# EAGLE design Schematic (EAGLE 9.6.2)
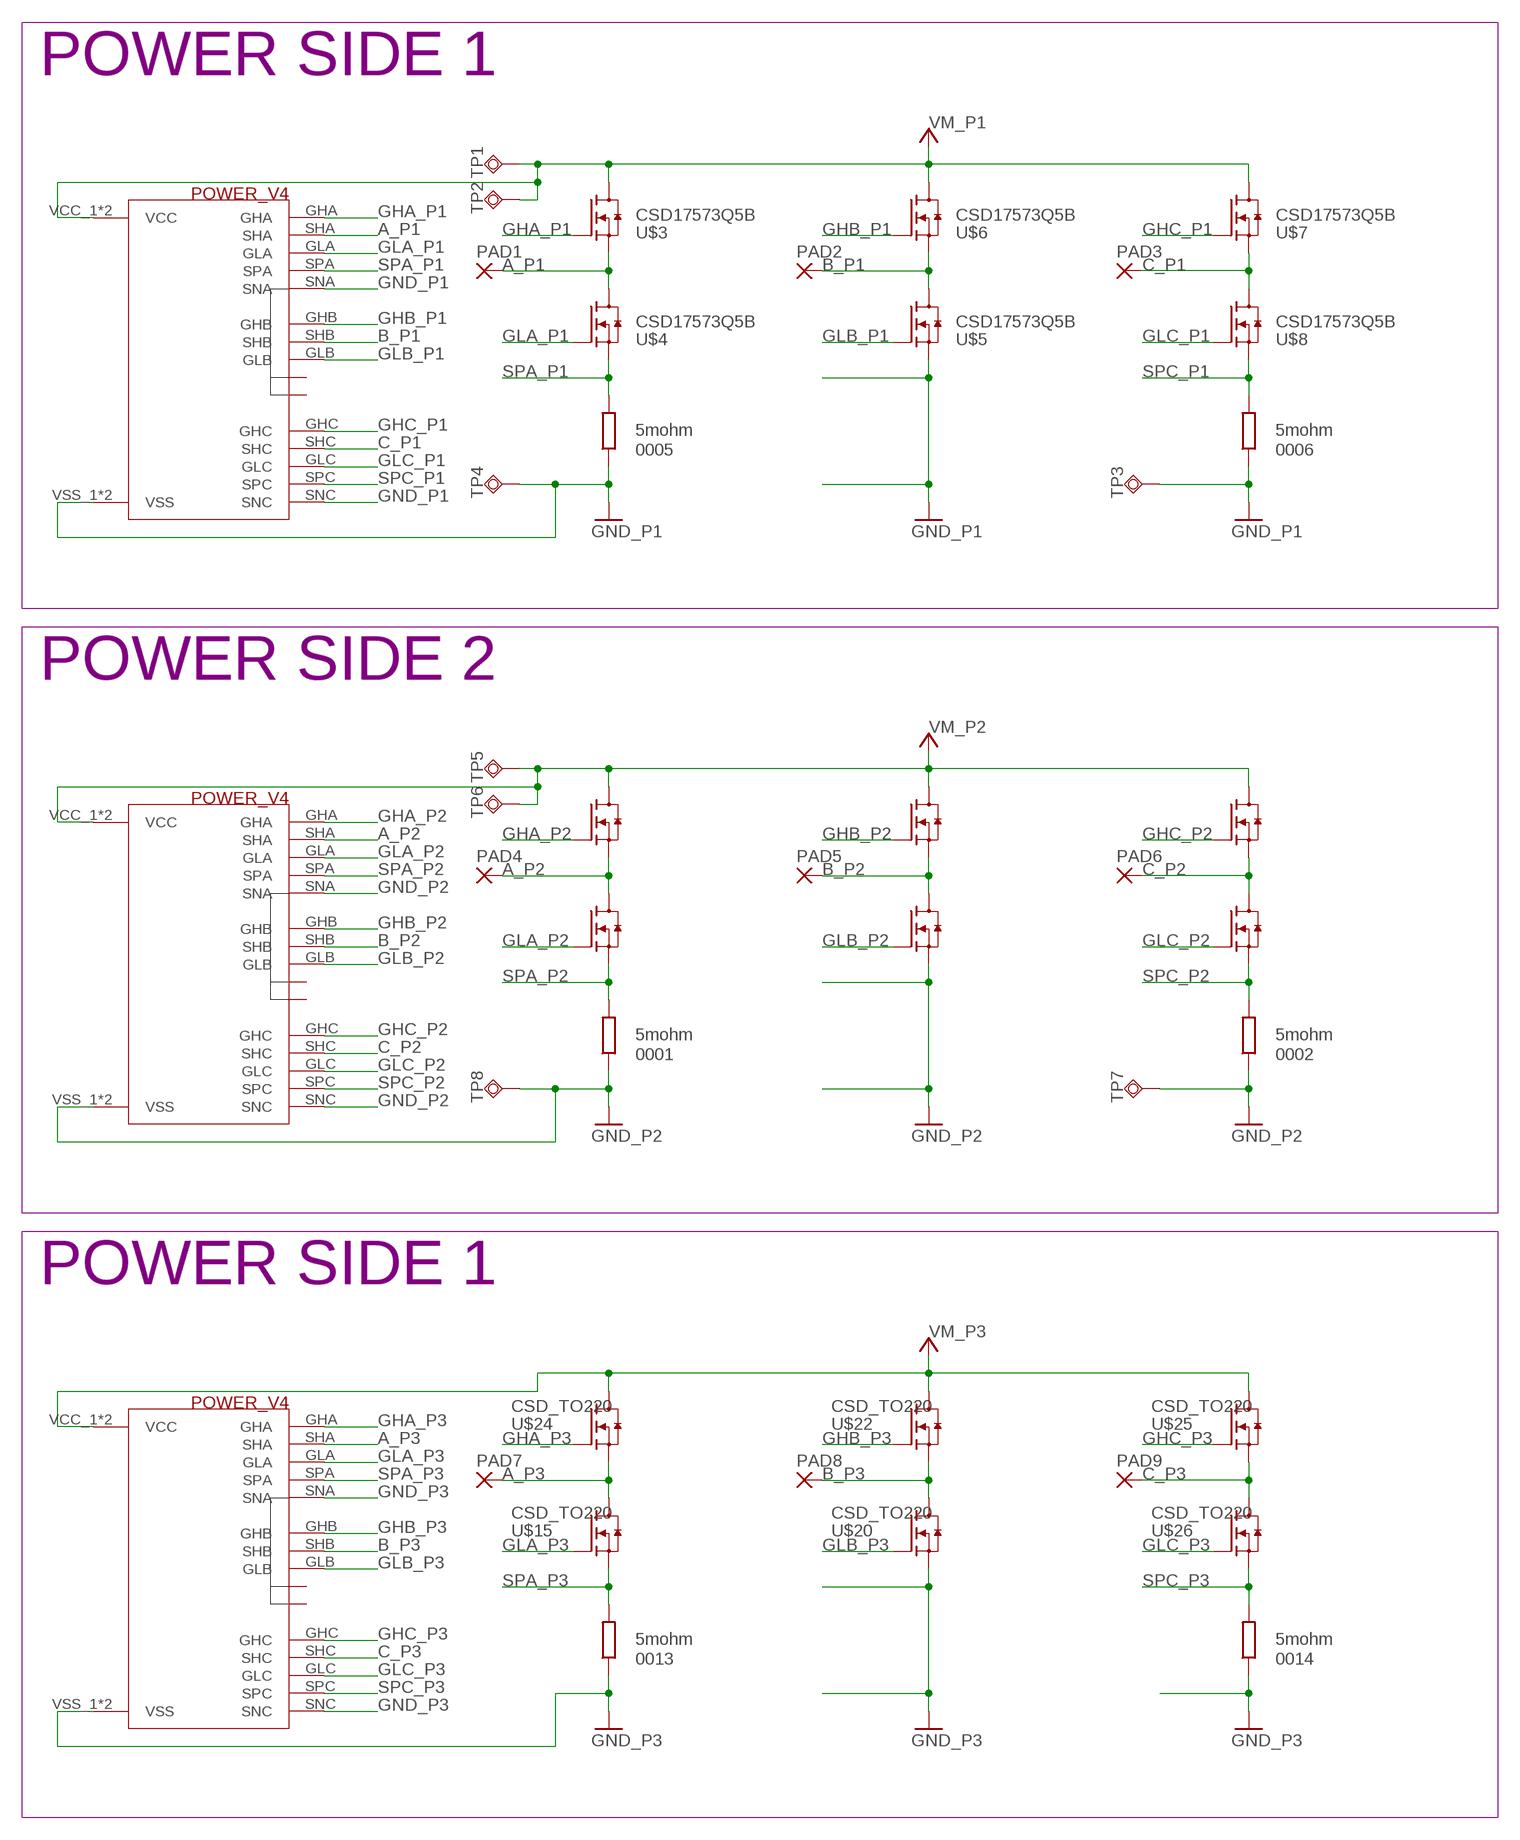
[diagram p0: schematic, sheet 1, part 1 of 3]
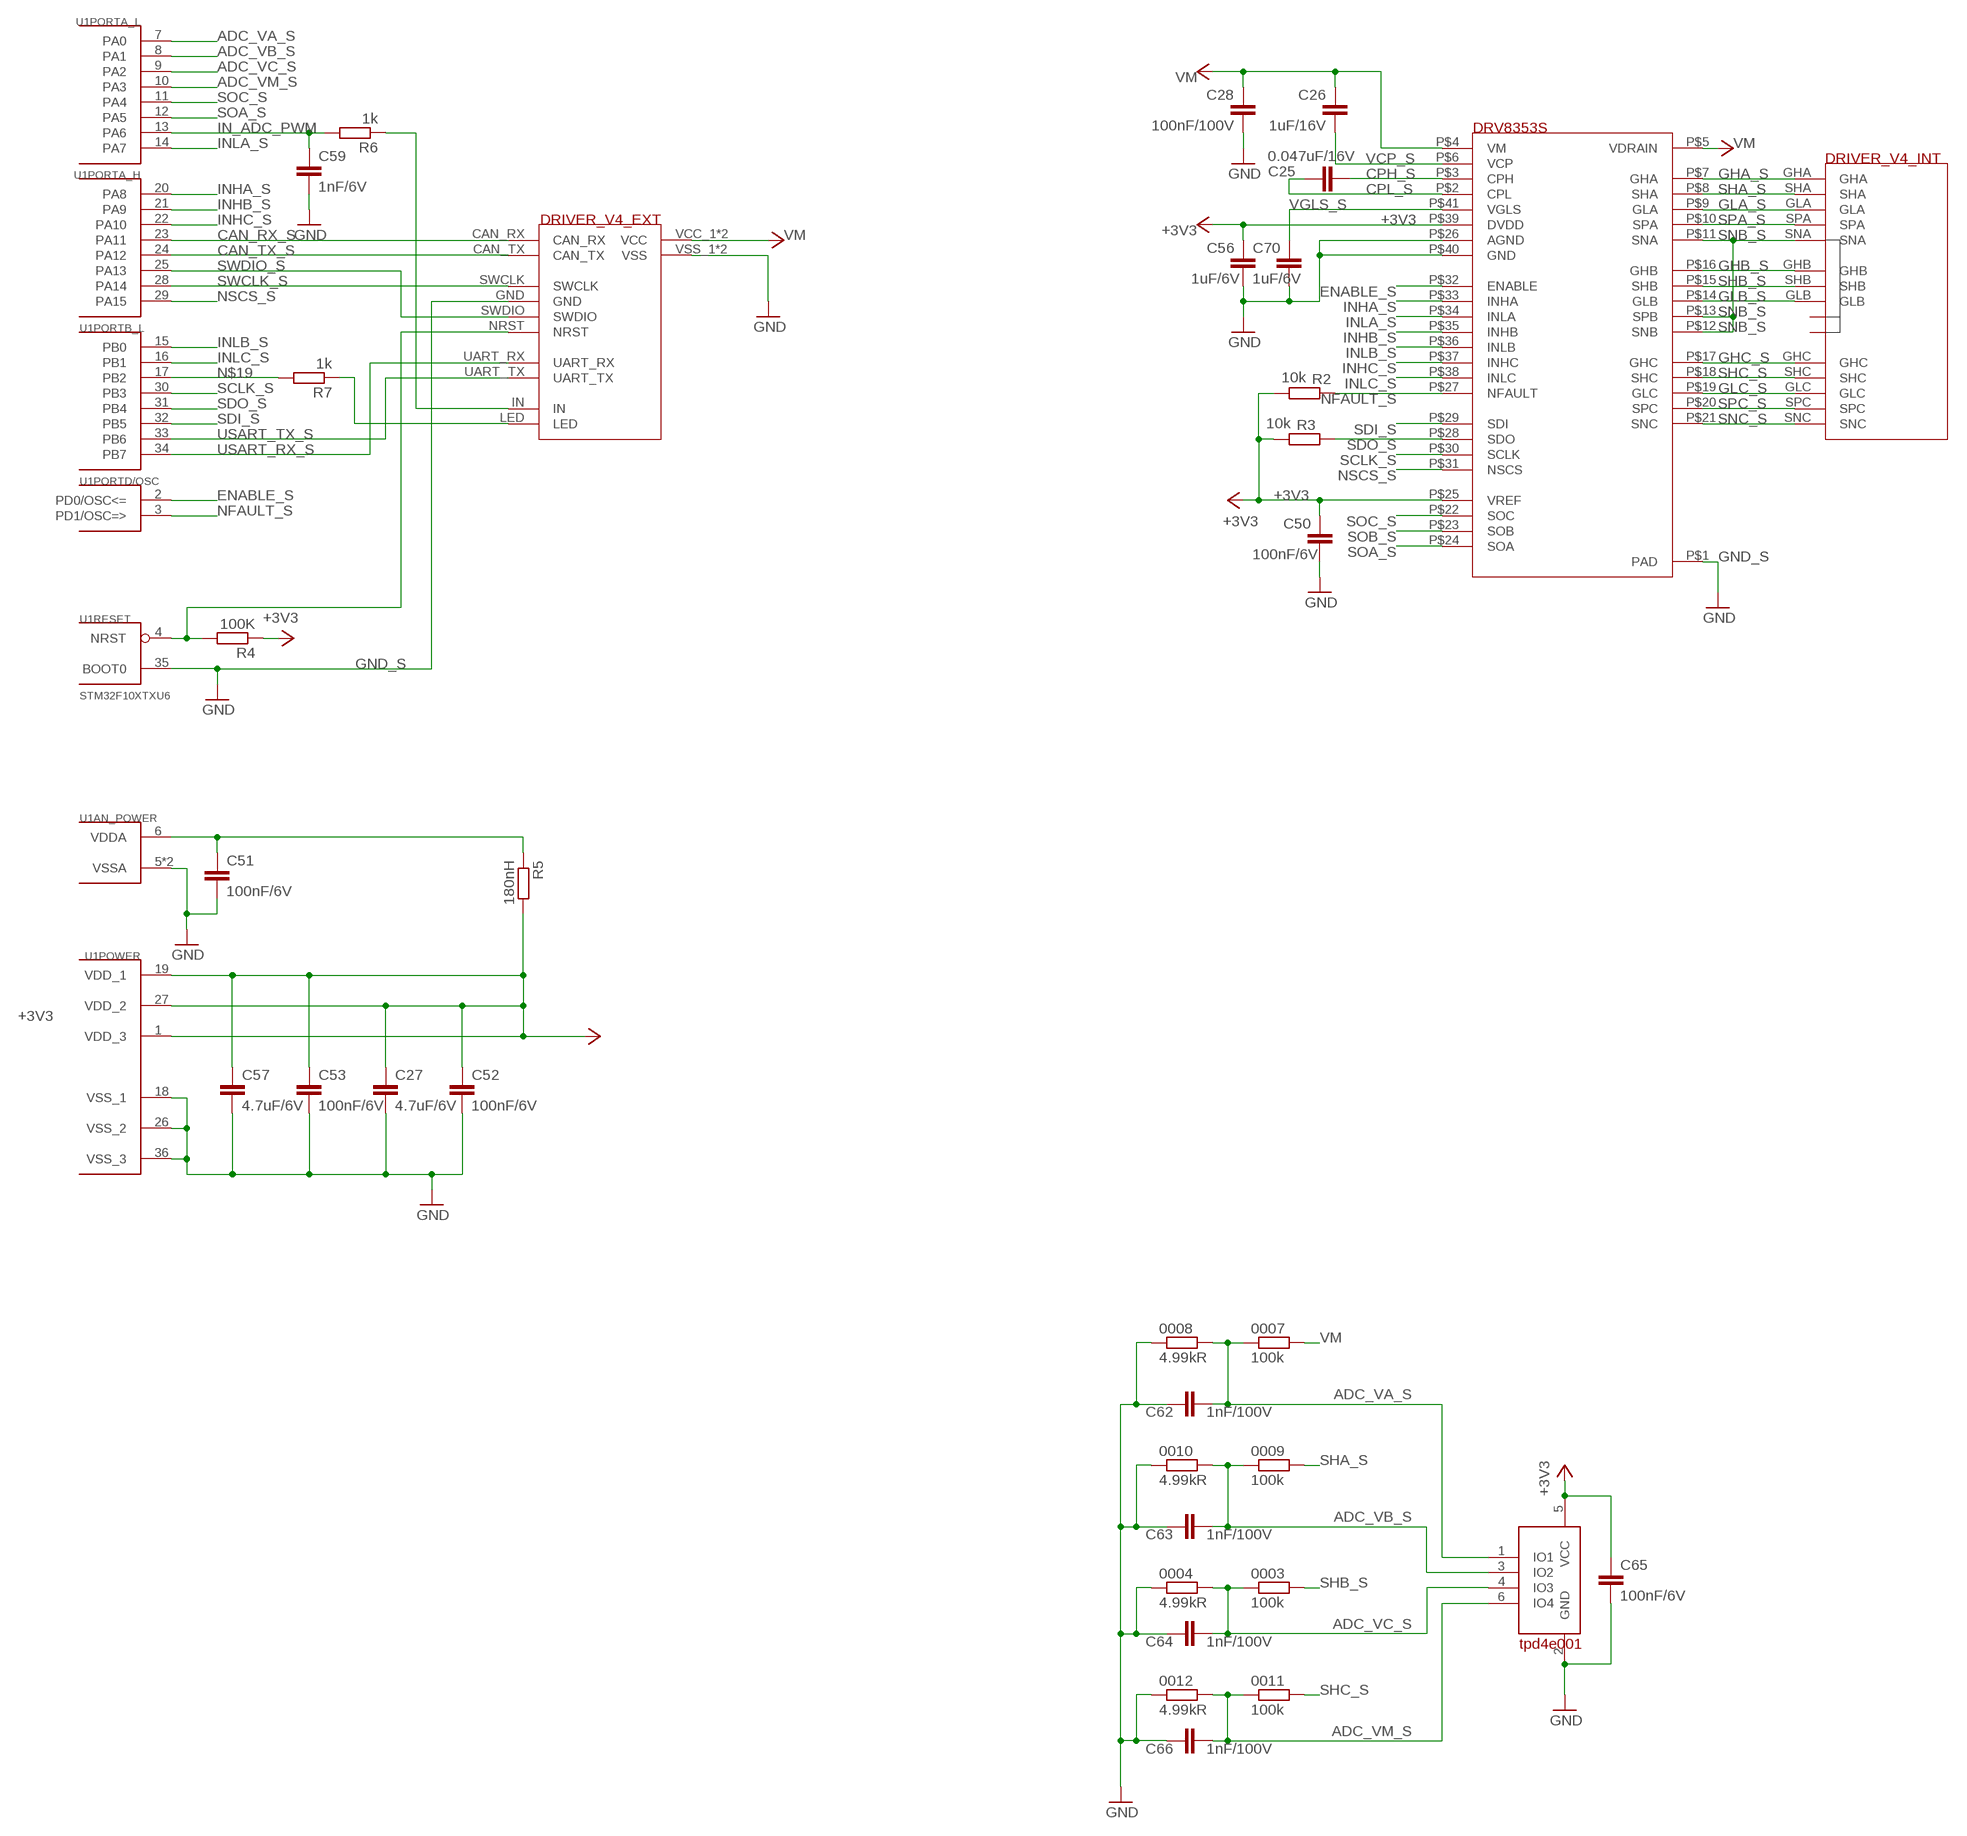
[diagram p1: schematic, sheet 1, part 2 of 3]
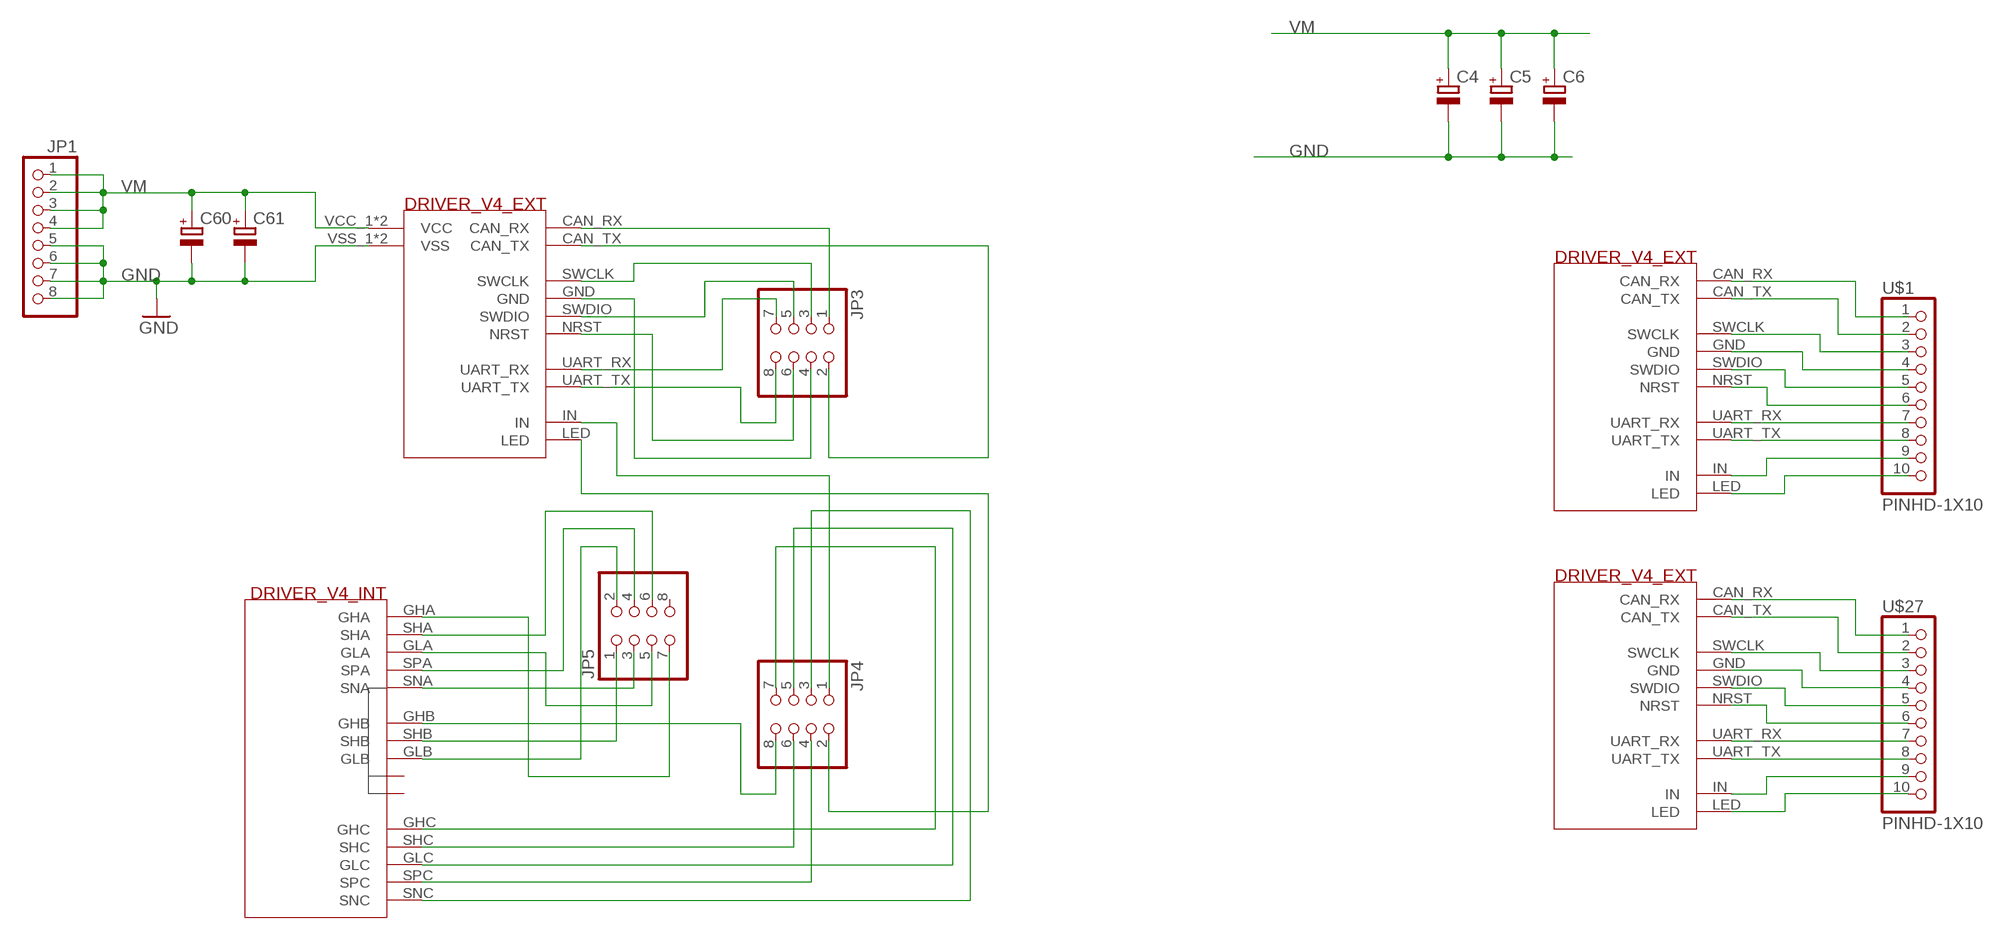
[diagram p2: schematic, sheet 1, part 3 of 3]

## Parts
0001  5mohm  R-EU_R2512  [R2512]
0002  5mohm  R-EU_R2512  [R2512]
0003  100k  R-EU_R0402  [R0402]
0004  4.99kR  R-EU_R0402  [R0402]
0005  5mohm  R-EU_R2512  [R2512]
0006  5mohm  R-EU_R2512  [R2512]
0007  100k  R-EU_R0402  [R0402]
0008  4.99kR  R-EU_R0402  [R0402]
0009  100k  R-EU_R0402  [R0402]
0010  4.99kR  R-EU_R0402  [R0402]
0011  100k  R-EU_R0402  [R0402]
0012  4.99kR  R-EU_R0402  [R0402]
0013  5mohm  R-EU_R2512  [R2512]
0014  5mohm  R-EU_R2512  [R2512]
C4  CPOL-EUE3.5-10  [E3,5-10]
C5  CPOL-EUE3.5-10  [E3,5-10]
C6  CPOL-EUE3.5-10  [E3,5-10]
C25  0.047uF/16V  C-EU  [R0402]
C26  1uF/16V  C-EU  [R0402]
C27  4.7uF/6V  C-EU  [R0402]
C28  100nF/100V  C-EU  [R0402]
C50  100nF/6V  C-EU  [R0402]
C51  100nF/6V  C-EU  [R0402]
C52  100nF/6V  C-EU  [R0402]
C53  100nF/6V  C-EU  [R0402]
C56  1uF/6V  C-EU  [R0402]
C57  4.7uF/6V  C-EU  [R0402]
C59  1nF/6V  C-EU  [R0402]
C60  CPOL-EUE3.5-10  [E3,5-10]
C61  CPOL-EUE3.5-10  [E3,5-10]
C62  1nF/100V  C-EU  [R0402]
C63  1nF/100V  C-EU  [R0402]
C64  1nF/100V  C-EU  [R0402]
C65  100nF/6V  C-EU  [R0402]
C66  1nF/100V  C-EU  [R0402]
C70  1uF/6V  C-EU  [R0402]
JP1  PINHD-1X8BIG  [1X08-BIG]
JP3  PINHD-2X4  [2X04]
JP4  PINHD-2X4  [2X04]
JP5  PINHD-2X4  [2X04]
PAD1  SMD5  [SMD2,54-5,08]
PAD2  SMD5  [SMD2,54-5,08]
PAD3  SMD5  [SMD2,54-5,08]
PAD4  SMD5  [SMD2,54-5,08]
PAD5  SMD5  [SMD2,54-5,08]
PAD6  SMD5  [SMD2,54-5,08]
PAD7  SMD5  [SMD2,54-5,08]
PAD8  SMD5  [SMD2,54-5,08]
PAD9  SMD5  [SMD2,54-5,08]
R2  10k  R-EU_R0402  [R0402]
R3  10k  R-EU_R0402  [R0402]
R4  100K  R-EU_R0402  [R0402]
R5  180nH  R-EU_R0402  [R0402]
R6  1k  R-EU_R0402  [R0402]
R7  1k  R-EU_R0402  [R0402]
TP1  TPSQTP20SQ  [TP20SQ]
TP2  TPSQTP20SQ  [TP20SQ]
TP3  TPSQTP20SQ  [TP20SQ]
TP4  TPSQTP20SQ  [TP20SQ]
TP5  TPSQTP20SQ  [TP20SQ]
TP6  TPSQTP20SQ  [TP20SQ]
TP7  TPSQTP20SQ  [TP20SQ]
TP8  TPSQTP20SQ  [TP20SQ]
U1  STM32F10XTXU6  [VFQFPN36]
U$1  PINHD-1X10  [1X10-BIG]
U$2  UBER_V4_DEVICE  [DRIVER_V4_DEVICE]
U$3  CSD17573Q5B  [Q5B]
U$4  CSD17573Q5B  [Q5B]
U$5  CSD17573Q5B  [Q5B]
U$6  CSD17573Q5B  [Q5B]
U$7  CSD17573Q5B  [Q5B]
U$8  CSD17573Q5B  [Q5B]
U$9  TPD4E001  [SOT-23]
U$10  INFINEON_007N06N  [PG-HSOF-8]
U$11  INFINEON_007N06N  [PG-HSOF-8]
U$12  INFINEON_007N06N  [PG-HSOF-8]
U$13  INFINEON_007N06N  [PG-HSOF-8]
U$14  INFINEON_007N06N  [PG-HSOF-8]
U$15  CSD_TO220  [TO220]
U$16  DRV8353S  [40-PIN_WQFN]
U$17  UBER_V4_MASTER  [DRIVER_V4_MASTER]
U$18  INFINEON_007N06N  [PG-HSOF-8]
U$19  UBER_V4_POWER  [DRIVER_V4_POWER]
U$20  CSD_TO220  [TO220]
U$21  UBER_V4&P1  [DRIVER_V4&P1]
U$22  CSD_TO220  [TO220]
U$23  UBER_V4_DEVICE  [DRIVER_V4_DEVICE]
U$24  CSD_TO220  [TO220]
U$25  CSD_TO220  [TO220]
U$26  CSD_TO220  [TO220]
U$27  PINHD-1X10  [1X10-BIG]
U$29  UBER_V4_POWER  [DRIVER_V4_POWER]
U$38  UBER_V4_POWER  [DRIVER_V4_POWER]

## Nets
+3V3: C27.1 C50.1 C52.1 C53.1 C56.1 C57.1 C65.1 R2.1 R3.1 R4.1 R5.2 U1.1(POWER:VDD_3) U1.19(POWER:VDD_1) U1.27(POWER:VDD_2) U$9.5(VCC) U$16.P$25(VREF) U$16.P$39(DVDD)
A_P1: PAD1.1(P) U$3.S U$4.D1(D) U$38.SHA
A_P2: PAD4.1(P) U$10.D U$18.S U$19.SHA
A_P3: PAD7.1(P) U$15.D U$24.S U$29.SHA
ADC_VA_S: 0007.1 0008.2 C62.1 U1.7(PORTA_L:PA0) U$9.1(IO1)
ADC_VB_S: 0009.1 0010.2 C63.1 U1.8(PORTA_L:PA1) U$9.3(IO2)
ADC_VC_S: 0003.1 0004.2 C64.1 U1.9(PORTA_L:PA2) U$9.4(IO3)
ADC_VM_S: 0011.1 0012.2 C66.1 U1.10(PORTA_L:PA3) U$9.6(IO4)
B_P1: PAD2.1(P) U$5.D1(D) U$6.S U$38.SHB
B_P2: PAD5.1(P) U$11.S U$12.D U$19.SHB
B_P3: PAD8.1(P) U$20.D U$22.S U$29.SHB
C_P1: PAD3.1(P) U$7.S U$8.D1(D) U$38.SHC
C_P2: PAD6.1(P) U$13.S U$14.D U$19.SHC
C_P3: PAD9.1(P) U$25.S U$26.D U$29.SHC
CAN_RX_S: U1.23(PORTA_H:PA11) U$17.CAN_RX
CAN_TX_S: U1.24(PORTA_H:PA12) U$17.CAN_TX
CPH_S: C25.1 U$16.P$3(CPH)
CPL_S: C25.2 U$16.P$2(CPL)
ENABLE_S: U1.2(PORTD/OSC:PD0/OSC<=) U$16.P$32(ENABLE)
GHA_P1: U$3.G U$38.GHA
GHA_P2: U$18.G U$19.GHA
GHA_P3: U$24.G U$29.GHA
GHA_S: U$16.P$7(GHA) U$17.GHA
GHB_P1: U$6.G U$38.GHB
GHB_P2: U$11.G U$19.GHB
GHB_P3: U$22.G U$29.GHB
GHB_S: U$16.P$16(GHB) U$17.GHB
GHC_P1: U$7.G U$38.GHC
GHC_P2: U$13.G U$19.GHC
GHC_P3: U$25.G U$29.GHC
GHC_S: U$16.P$17(GHC) U$17.GHC
GLA_P1: U$4.G U$38.GLA
GLA_P2: U$10.G U$19.GLA
GLA_P3: U$15.G U$29.GLA
GLA_S: U$16.P$9(GLA) U$17.GLA
GLB_P1: U$5.G U$38.GLB
GLB_P2: U$12.G U$19.GLB
GLB_P3: U$20.G U$29.GLB
GLB_S: U$16.P$14(GLB) U$17.GLB
GLC_P1: U$8.G U$38.GLC
GLC_P2: U$14.G U$19.GLC
GLC_P3: U$26.G U$29.GLC
GLC_S: U$16.P$19(GLC) U$17.GLC
GND: C4.- C5.- C6.- C60.- C61.- JP1.5 JP1.6 JP1.7 JP1.8 U$21.VSS_1(VSS) U$21.VSS_2(VSS)
GND_P1: 0005.1 0006.1 TP3.TP TP4.TP U$5.S U$38.SNA U$38.SNC U$38.VSS_1(VSS) U$38.VSS_2(VSS) ; supply symbol labelled GND
GND_P2: 0001.1 0002.1 TP7.TP TP8.TP U$12.S U$19.SNA U$19.SNC U$19.VSS_1(VSS) U$19.VSS_2(VSS) ; supply symbol labelled GND
GND_P3: 0013.1 0014.1 U$20.S U$29.SNA U$29.SNC U$29.VSS_1(VSS) U$29.VSS_2(VSS) ; supply symbol labelled GND
GND_S: 0004.1 0008.1 0010.1 0012.1 C27.2 C28.2 C50.2 C51.2 C52.2 C53.2 C56.2 C57.2 C59.2 C62.2 C63.2 C64.2 C65.2 C66.2 C70.2 U1.5(AN_POWER:VSSA) U1.18(POWER:VSS_1) U1.26(POWER:VSS_2) U1.35(RESET:BOOT0) U1.36(POWER:VSS_3) U1.P$1(AN_POWER:VSSA) U$9.2(GND) U$16.P$1(PAD) U$16.P$26(AGND) U$16.P$40(GND) U$17.GND U$17.VSS_1(VSS) U$17.VSS_2(VSS) ; supply symbol labelled GND
IN_ADC_PWM: R6.1 U$17.IN
INHA_S: U1.20(PORTA_H:PA8) U$16.P$33(INHA)
INHB_S: U1.21(PORTA_H:PA9) U$16.P$35(INHB)
INHC_S: U1.22(PORTA_H:PA10) U$16.P$37(INHC)
INLA_S: U1.14(PORTA_L:PA7) U$16.P$34(INLA)
INLB_S: U1.15(PORTB_L:PB0) U$16.P$36(INLB)
INLC_S: U1.16(PORTB_L:PB1) U$16.P$38(INLC)
LED_S: R7.1 U$17.LED
N$1: JP4.3 U$21.SNC
N$2: JP4.4 U$21.SPC
N$3: JP4.5 U$21.GLC
N$4: JP4.6 U$21.SHC
N$5: JP4.7 U$21.GHC
N$6: JP4.8 U$21.GHB
N$7: JP5.1 U$21.SHB
N$8: JP5.2 U$21.GLB
N$9: JP5.3 U$21.SNA
N$10: JP5.4 U$21.SPA
N$11: JP5.5 U$21.GLA
N$12: JP5.6 U$21.SHA
N$13: JP5.7 U$21.GHA
N$14: JP3.1 U$21.CAN_RX
N$15: C51.1 R5.1 U1.6(AN_POWER:VDDA)
N$16: JP3.2 U$21.CAN_TX
N$17: C59.1 R6.2 U1.13(PORTA_L:PA6)
N$18: U$1.1 U$2.CAN_RX
N$19: R7.2 U1.17(PORTB_L:PB2)
N$20: JP3.3 U$21.SWCLK
N$21: JP3.4 U$21.GND
N$22: JP3.5 U$21.SWDIO
N$23: JP3.6 U$21.NRST
N$24: U$1.2 U$2.CAN_TX
N$25: JP3.7 U$21.UART_RX
N$26: JP3.8 U$21.UART_TX
N$27: JP4.1 U$21.IN
N$28: JP4.2 U$21.LED
N$29: U$1.3 U$2.SWCLK
N$30: U$1.4 U$2.GND
N$31: U$1.5 U$2.SWDIO
N$32: U$1.6 U$2.NRST
N$33: U$1.7 U$2.UART_RX
N$34: U$1.8 U$2.UART_TX
N$35: U$1.9 U$2.IN
N$36: U$1.10 U$2.LED
N$37: U$23.CAN_RX U$27.1
N$38: U$23.CAN_TX U$27.2
N$39: U$23.SWCLK U$27.3
N$40: U$23.GND U$27.4
N$41: U$23.SWDIO U$27.5
N$42: U$23.NRST U$27.6
N$43: U$23.UART_RX U$27.7
N$44: U$23.UART_TX U$27.8
N$45: U$23.IN U$27.9
N$46: U$23.LED U$27.10
NFAULT_S: R2.2 U1.3(PORTD/OSC:PD1/OSC=>) U$16.P$27(NFAULT)
NRST_S: R4.2 U1.4(RESET:NRST) U$17.NRST
NSCS_S: U1.29(PORTA_H:PA15) U$16.P$31(NSCS)
SCLK_S: U1.30(PORTB_L:PB3) U$16.P$30(SCLK)
SDI_S: U1.32(PORTB_L:PB5) U$16.P$29(SDI)
SDO_S: R3.2 U1.31(PORTB_L:PB4) U$16.P$28(SDO)
SHA_S: 0009.2 U$16.P$8(SHA) U$17.SHA
SHB_S: 0003.2 U$16.P$15(SHB) U$17.SHB
SHC_S: 0011.2 U$16.P$18(SHC) U$17.SHC
SNB_S: U$16.P$11(SNA) U$16.P$12(SNB) U$16.P$13(SPB) U$17.SNA
SNC_S: U$16.P$21(SNC) U$17.SNC
SOA_S: U1.12(PORTA_L:PA5) U$16.P$24(SOA)
SOB_S: U$16.P$23(SOB)
SOC_S: U1.11(PORTA_L:PA4) U$16.P$22(SOC)
SPA_P1: 0005.2 U$4.S U$38.SPA
SPA_P2: 0001.2 U$10.S U$19.SPA
SPA_P3: 0013.2 U$15.S U$29.SPA
SPA_S: U$16.P$10(SPA) U$17.SPA
SPC_P1: 0006.2 U$8.S U$38.SPC
SPC_P2: 0002.2 U$14.S U$19.SPC
SPC_P3: 0014.2 U$26.S U$29.SPC
SPC_S: U$16.P$20(SPC) U$17.SPC
SWCLK_S: U1.28(PORTA_H:PA14) U$17.SWCLK
SWDIO_S: U1.25(PORTA_H:PA13) U$17.SWDIO
USART_RX_S: U1.34(PORTB_L:PB7) U$17.UART_RX
USART_TX_S: U1.33(PORTB_L:PB6) U$17.UART_TX
VCP_S: C26.2 U$16.P$6(VCP)
VGLS_S: C70.1 U$16.P$41(VGLS)
VM: 0007.2 C4.+ C5.+ C6.+ C26.1 C28.1 C60.+ C61.+ JP1.1 JP1.2 JP1.3 JP1.4 U$16.P$4(VM) U$16.P$5(VDRAIN) U$17.VCC_1(VCC) U$17.VCC_2(VCC) U$21.VCC_1(VCC) U$21.VCC_2(VCC) ; supply symbol labelled VMotor
VM_P1: TP1.TP TP2.TP U$3.D1(D) U$6.D1(D) U$7.D1(D) U$38.VCC_1(VCC) U$38.VCC_2(VCC) ; supply symbol labelled VMotor
VM_P2: TP5.TP TP6.TP U$11.D U$13.D U$18.D U$19.VCC_1(VCC) U$19.VCC_2(VCC) ; supply symbol labelled VMotor
VM_P3: U$22.D U$24.D U$25.D U$29.VCC_1(VCC) U$29.VCC_2(VCC) ; supply symbol labelled VMotor
Unconnected: JP5.8

## Notes on the sheet
- POWER SIDE 1
- POWER SIDE 2
- POWER SIDE 1

## Library data of the parts
0001 0002 0005 0006 0013 0014 = resistor:R-EU_: RESISTOR, European symbol
0003 0004 0007-0009 0010-0012 R2-R7 = rcl:R-EU_: RESISTOR, European symbol; SPICEPREFIX: R
C4-C6 C60 C61 = rcl:CPOL-EU: POLARIZED CAPACITOR, European symbol; SPICEPREFIX: C
C25-C28 C50-C53 C56 C57 C59 C62-C66 C70 = rcl:C-EU: CAPACITOR, European symbol
JP1 = adafruit:PINHD-1X8: PIN HEADER
JP3-JP5 = adafruit:PINHD-2X4: PIN HEADER
PAD1-PAD9 = wirepad:SMD5: SMD PAD
TP1-TP8 = testpad:TPSQ: Test pad
U1 = stm32:STM32F10XTXU6: STM32F101/103 36pad VFQPFN36
U$1 U$27 = adafruit:PINHD-1X10: Pin header 1x10 0.1" spacing With round pins
U$2 U$23 = UBER_DRIVER:UBER_V4_DEVICE
U$3-U$8 = CSD_Mosfet:CSD17573Q5B
U$9 = tpd4e001:TPD4E001
U$10-U$14 U$18 = CSD_Mosfet:INFINEON_007N06N
U$15 U$20 U$22 U$24-U$26 = CSD_Mosfet:CSD_TO220
U$16 = drv8305lbr:DRV8353S
U$17 = UBER_DRIVER:UBER_V4_MASTER
U$19 U$29 U$38 = UBER_DRIVER:UBER_V4_POWER
U$21 = UBER_DRIVER:UBER_V4&P1

## Board
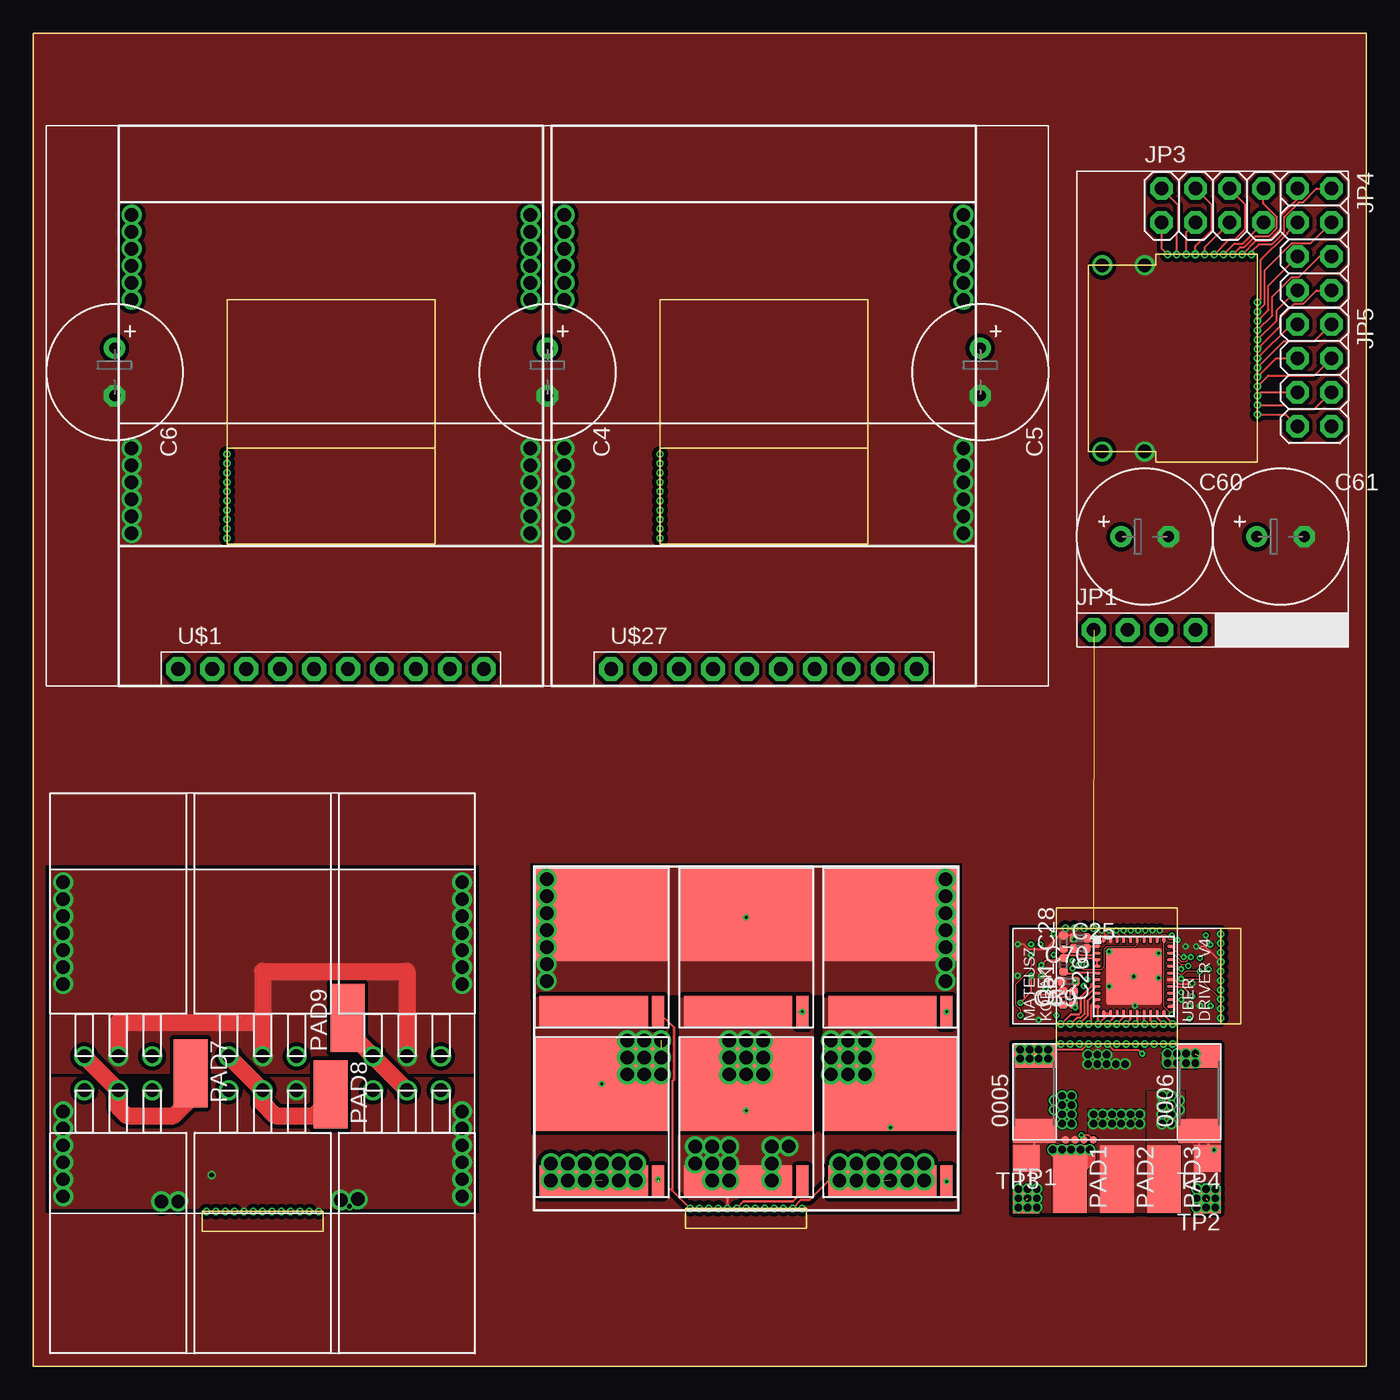
[diagram p3: board, top side]
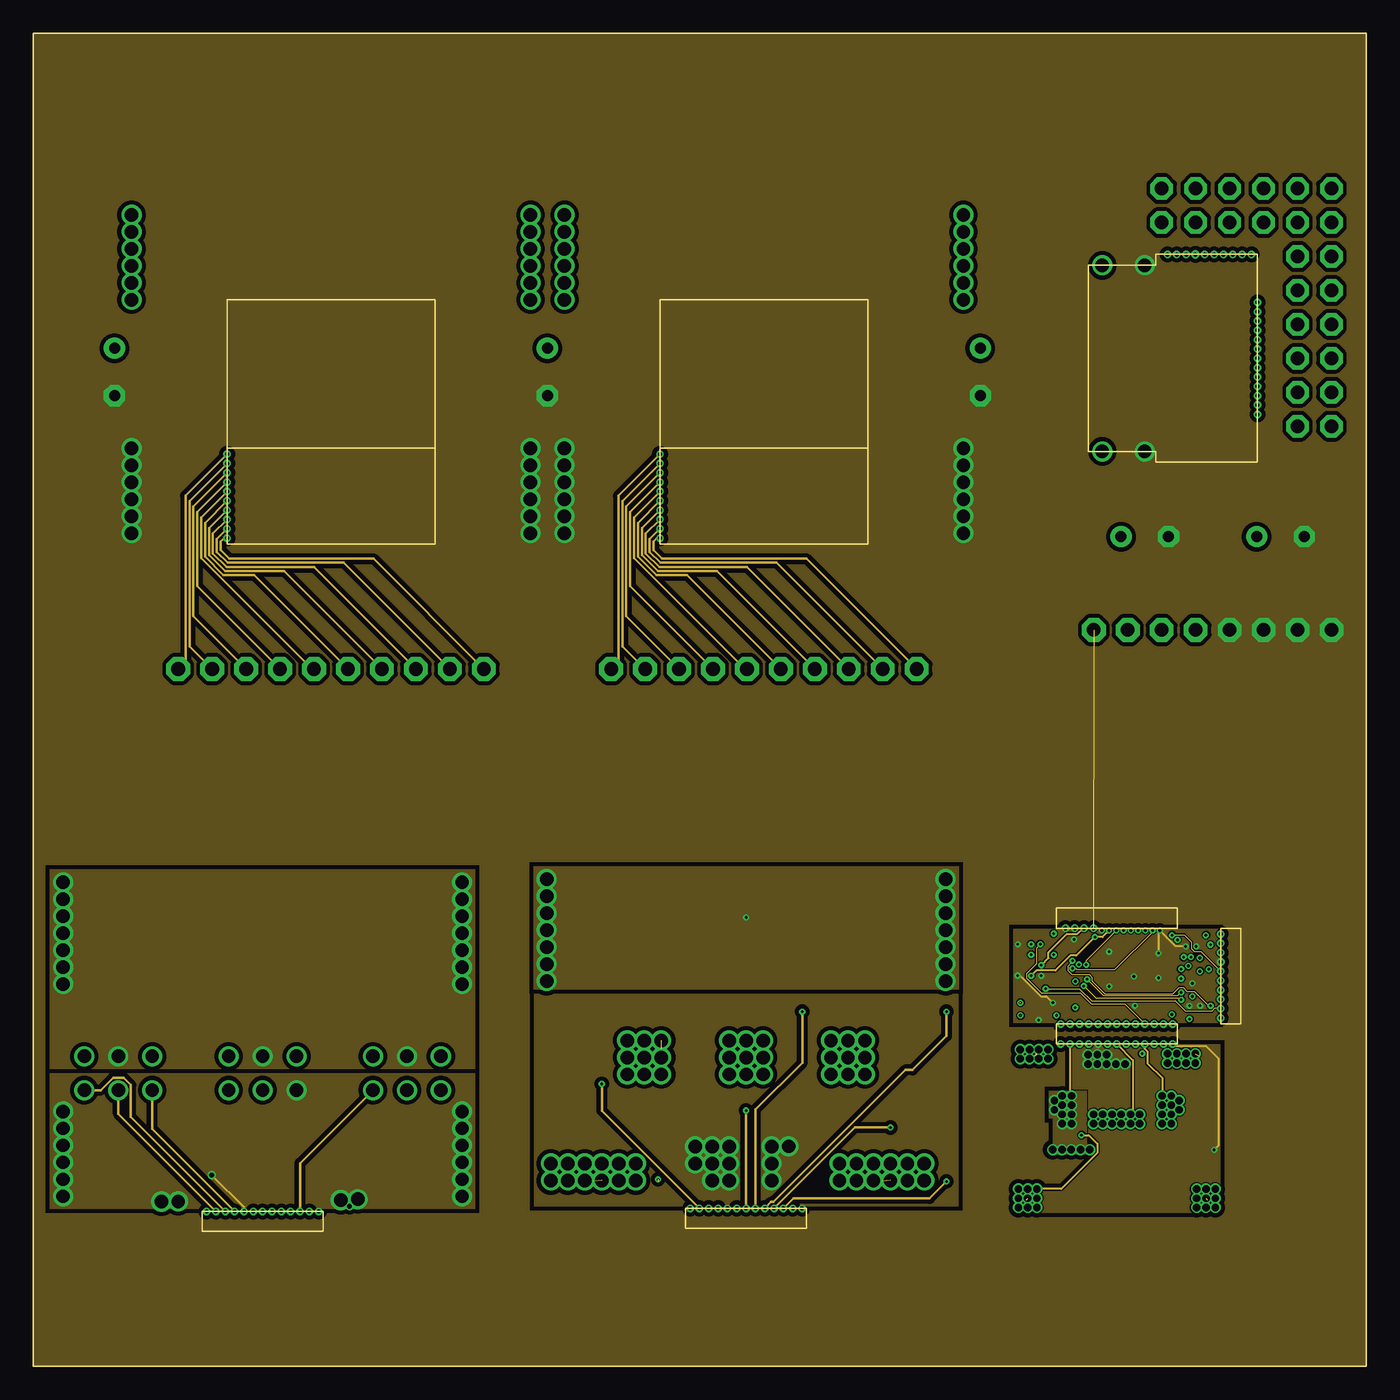
[diagram p4: board, inner layer Route2]
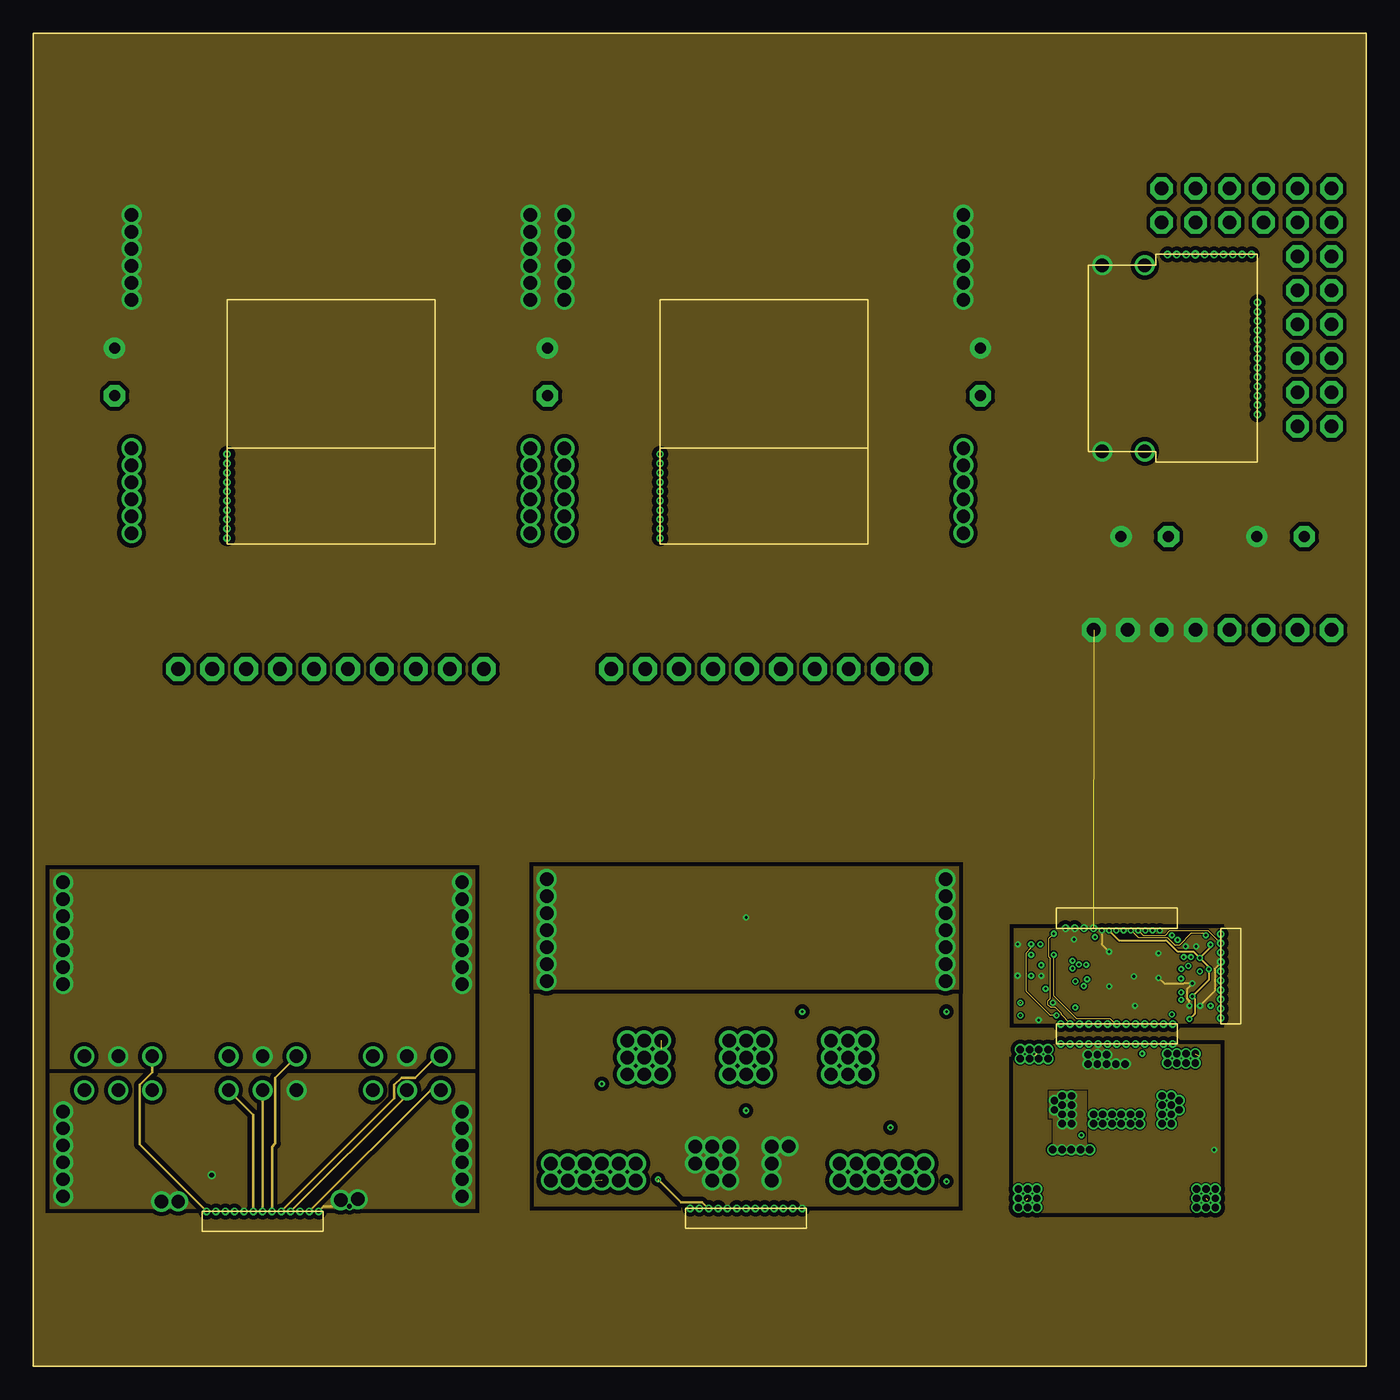
[diagram p5: board, inner layer Route15]
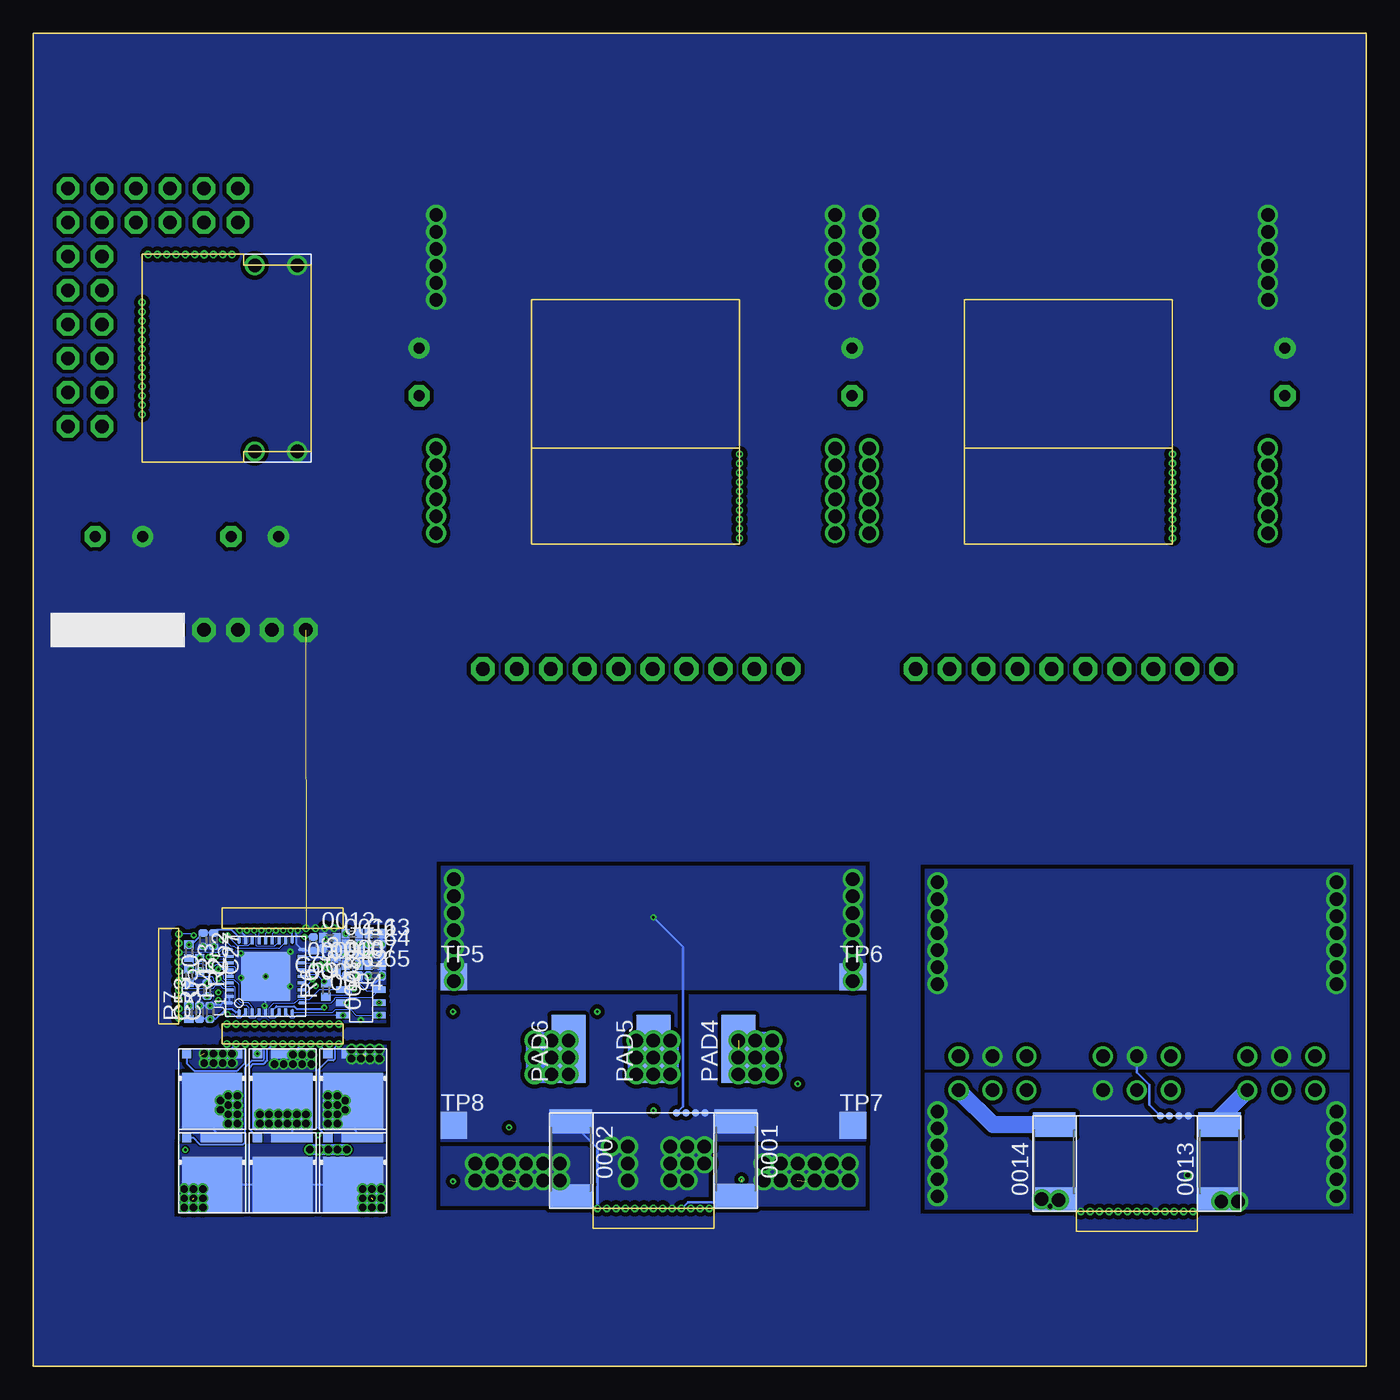
[diagram p6: board, bottom side, seen from below]

Size 99.69 x 99.69 mm. Coordinates in mm from the lower left corner, seen from the top.
Outline: 46.88,68.66 46.88,79.77 62.42,79.77 62.42,68.66
Outline: 76.52,32.76 76.52,34.27 85.57,34.27 85.57,32.76 76.52,32.76
Outline: 76.52,24.09 76.52,25.6 85.57,25.6 85.57,24.09 76.52,24.09
Outline: 90.32,25.6 88.82,25.6 88.82,32.76 90.32,32.76 90.32,25.6
Outline: 12.62,10.06 12.62,11.57 21.67,11.57 21.67,10.06 12.62,10.06
Outline: 48.79,10.29 48.79,11.8 57.84,11.8 57.84,10.29 48.79,10.29
Outline: 0,0 99.69,0 99.69,99.69 0,99.69 0,0
Outline: 14.49,68.66 14.49,79.77 30.04,79.77 30.04,68.66 14.49,68.66
Copper layers (1*2*15*16): Top 0.035mm / dielectric 0.2mm / Route2 0.017mm / dielectric 0.2mm / Route15 0.017mm / dielectric 0.2mm / Bottom 0.035mm
Design rules "default *": minimum track width 3.5mil, minimum drill 0.2mm, track to track 3.5mil, track to pad 3.5mil, pad to pad 3.5mil, via to via 3.5mil, smd to smd 0mil, copper to edge 0mil, drill to drill 0mil, minimum pad ring 5mil, minimum via ring 5mil, stop-mask expansion 1mil, vias tented up to drill 0mil, thermal gap 0mil

### Footprints (pad centres in the part's own frame; a part is rotated, then mirrored left to right if it is on the bottom)
R2512 = smd 1.8 x 3.2: 1 -2.8,0; 2 2.8,0
R0402 = smd 0.6 x 0.7: 1 -0.5,0; 2 0.5,0
E3,5-10 = drill 0.813 pad 1.6: + -1.778,0 | drill 0.813 pad 1.6 octagon: - 1.778,0
1X08-BIG = drill 1.016 pad 1.778 octagon: 1 -8.89,0; 2 -6.35,0; 3 -3.81,0; 4 -1.27,0; 5 1.27,0; 6 3.81,0; 7 6.35,0; 8 8.89,0
2X04 = drill 1.016 pad 1.676 octagon: 1 -3.81,-1.27; 2 -3.81,1.27; 3 -1.27,-1.27; 4 -1.27,1.27; 5 1.27,-1.27; 6 1.27,1.27; 7 3.81,-1.27; 8 3.81,1.27
SMD2,54-5,08 = smd 2.54 x 5.08: 1 0,0
TP20SQ = smd 2 x 2: TP 0,0
VFQFPN36 = smd 0.6 x 0.23: 1 -2.7,2; 2 -2.7,1.5; 3 -2.7,1; 4 -2.7,0.5; 5 -2.7,0; 6 -2.7,-0.5; 7 -2.7,-1; 8 -2.7,-1.5; 9 -2.7,-2; 19 2.7,-2; 20 2.7,-1.5; 21 2.7,-1; 22 2.7,-0.5; 23 2.7,0; 24 2.7,0.5; 25 2.7,1; 26 2.7,1.5; 27 2.7,2 | smd 0.23 x 0.6: 10 -2,-2.7; 11 -1.5,-2.7; 12 -1,-2.7; 13 -0.5,-2.7; 14 0,-2.7; 15 0.5,-2.7; 16 1,-2.7; 17 1.5,-2.7; 18 2,-2.7; 28 2,2.7; 29 1.5,2.7; 30 1,2.7; 31 0.5,2.7; 32 0,2.7; 33 -0.5,2.7; 34 -1,2.7; 35 -1.5,2.7; 36 -2,2.7 | smd 3.7 x 3.7: P$1 0,0
1X10-BIG = drill 1.016 pad 1.778 octagon: 1 -11.43,0; 2 -8.89,0; 3 -6.35,0; 4 -3.81,0; 5 -1.27,0; 6 1.27,0; 7 3.81,0; 8 6.35,0; 9 8.89,0; 10 11.43,0
DRIVER_V4_DEVICE = drill 0.3 pad 0.559: CAN_RX 7.772,-0.432; CAN_TX 7.772,-1.13; GND 7.772,-2.527; IN 7.772,-6.02; LED 7.772,-6.718; NRST 7.772,-3.924; SWCLK 7.772,-1.829; SWDIO 7.772,-3.226; UART_RX 7.772,-4.623; UART_TX 7.772,-5.321
Q5B = smd 4.2 x 4.5: D1 2.1,2.5 | smd 0.7 x 0.7: G 5.65,4.4 | smd 0.7 x 3.1: S 5.65,1.8
SOT-23 = smd 0.5 x 1: 1 0,0; 2 0.95,0; 3 1.9,0; 4 1.9,2.7; 5 0.95,2.7; 6 0,2.7
PG-HSOF-8 = smd 10 x 7: D 0,8.5 | smd 0.9 x 2.4: G 4.2,1.2 | smd 8.1 x 2.4: S -0.6,1.2
TO220 = drill 1: D 2.54,0; G 0,0; S 5.08,0
40-PIN_WQFN = smd 4.15 x 4.15: P$1 0,0 | smd 0.5 x 0.22: P$2 -2.75,2.25; P$3 -2.75,1.75; P$4 -2.75,1.25; P$5 -2.75,0.75; P$6 -2.75,0.25; P$7 -2.75,-0.25; P$8 -2.75,-0.75; P$9 -2.75,-1.25; P$10 -2.75,-1.75; P$11 -2.75,-2.25; P$22 2.75,-2.25; P$23 2.75,-1.75; P$24 2.75,-1.25; P$25 2.75,-0.75; P$26 2.75,-0.25; P$27 2.75,0.25; P$28 2.75,0.75; P$29 2.75,1.25; P$30 2.75,1.75; P$31 2.75,2.25 | smd 0.22 x 0.5: P$12 -2.25,-2.75; P$13 -1.75,-2.75; P$14 -1.25,-2.75; P$15 -0.75,-2.75; P$16 -0.25,-2.75; P$17 0.25,-2.75; P$18 0.75,-2.75; P$19 1.25,-2.75; P$20 1.75,-2.75; P$21 2.25,-2.75; P$32 2.25,2.75; P$33 1.75,2.75; P$34 1.25,2.75; P$35 0.75,2.75; P$36 0.25,2.75; P$37 -0.25,2.75; P$38 -0.75,2.75; P$39 -1.25,2.75; P$40 -1.75,2.75; P$41 -2.25,2.75
DRIVER_V4_MASTER = drill 0.3 pad 0.559: CAN_RX 7.772,-0.432; CAN_TX 7.772,-1.13; GHA -4.191,-7.163; GHB 0.699,-7.163; GHC 1.397,-7.163; GLA -2.794,-7.163; GLB -0.699,-7.163; GLC 2.794,-7.163; IN 7.772,-6.02; LED 7.772,-6.718; NRST 7.772,-3.924; SHA -3.493,-7.163; SHB 0,-7.163; SHC 2.095,-7.163; SNA -1.397,-7.163; SNC 4.191,-7.163; SPA -2.095,-7.163; SPC 3.493,-7.163; SWCLK 7.772,-1.829; SWDIO 7.772,-3.226; UART_RX 7.772,-4.623; UART_TX 7.772,-5.321; VCC_1 -2.445,0; VCC_2 -1.746,0; VSS_1 -3.842,0; VSS_2 -3.143,0 | drill 0.3 pad 0.61: GND 7.772,-2.527
DRIVER_V4_POWER = drill 0.3 pad 0.559: GHA -4.191,-7.163; GHB 0.699,-7.163; GHC 1.397,-7.163; GLA -2.794,-7.163; GLB -0.699,-7.163; GLC 2.794,-7.163; SHA -3.493,-7.163; SHB 0,-7.163; SHC 2.095,-7.163; SNA -1.397,-7.163; SNC 4.191,-7.163; SPA -2.095,-7.163; SPC 3.493,-7.163 | smd 0.559 x 0.559 bottom: VCC_1 -2.445,0; VCC_2 -1.746,0; VSS_1 -3.842,0; VSS_2 -3.143,0
DRIVER_V4&P1 = drill 0.3 pad 0.559: CAN_RX 7.772,-0.432; CAN_TX 7.772,-1.13; GHA -4.191,-7.163; GHB 0.699,-7.163; GHC 1.397,-7.163; GLA -2.794,-7.163; GLB -0.699,-7.163; GLC 2.794,-7.163; IN 7.772,-6.02; LED 7.772,-6.718; NRST 7.772,-3.924; SHA -3.493,-7.163; SHB 0,-7.163; SHC 2.095,-7.163; SNA -1.397,-7.163; SNC 4.191,-7.163; SPA -2.095,-7.163; SPC 3.493,-7.163; SWCLK 7.772,-1.829; SWDIO 7.772,-3.226; UART_RX 7.772,-4.623; UART_TX 7.772,-5.321 | drill 0.3 pad 0.61: GND 7.772,-2.527 | drill 1: VCC_1 -6.96,4.445; VCC_2 6.96,4.445; VSS_1 -6.96,1.27; VSS_2 6.96,1.27

### Placement (x,y rotation side)
0001  47.16,15.52 270 bottom
0002  59.5,15.49 270 bottom
0003  75.83,30.77 180 bottom
0004  74.14,29.98 180 bottom
0005  74.87,20.4 90 top
0006  87.22,20.4 90 top
0007  75.83,29.98 0 bottom
0008  77.06,30.02 270 bottom
0009  75.83,32.35 180 bottom
0010  74.14,32.35 180 bottom
0011  75.83,31.56 0 bottom
0012  77.51,32.04 0 bottom
0013  10.96,15.27 90 bottom
0014  23.33,15.27 90 bottom
C4  38.46,74.37 270 top
C5  70.84,74.37 270 top
C6  6.07,74.37 270 top
C25  78.3,31.24 0 top
C26  77.06,30.02 270 top
C27  86.2,31.9 270 bottom
C28  77.06,31.71 90 top
C50  86.7,28.16 90 bottom
C51  77.03,27.54 90 top
C52  86.99,31.9 270 bottom
C53  87.27,26.46 90 bottom
C56  78.75,31.59 270 bottom
C57  86.49,26.46 90 bottom
C59  77.45,28.78 180 top
C60  83.13,62.05 0 top
C61  93.29,62.05 0 top
C62  75.83,29.2 0 bottom
C63  74.14,31.56 0 bottom
C64  74.14,30.77 0 bottom
C65  74.14,29.2 0 bottom
C66  77.51,31.25 180 bottom
C70  78.3,32.03 180 top
JP1  88.21,55.07 0 top
JP3  88.21,86.82 0 top
JP4  95.83,84.28 270 top
JP5  95.83,74.12 270 top
PAD1  77.53,13.99 180 top
PAD2  81.05,13.99 180 top
PAD3  84.57,13.99 180 top
PAD4  46.96,23.72 0 bottom
PAD5  53.31,23.72 0 bottom
PAD6  59.66,23.72 0 bottom
PAD7  11.75,21.91 180 top
PAD8  22.23,20.32 180 top
PAD9  23.5,26.04 0 top
R2  87.26,30.03 270 bottom
R3  88.05,31.03 270 bottom
R4  88.05,29.17 270 bottom
R5  77.81,27.54 90 top
R6  77.81,28.11 90 bottom
R7  88.06,26.46 90 bottom
TP1  74.27,12.45 0 top
TP2  87.83,12.45 180 top
TP3  74.27,15.53 180 top
TP4  87.83,15.53 180 top
TP5  68.24,29.12 0 bottom
TP6  38.39,29.12 0 bottom
TP7  38.39,18.01 0 bottom
TP8  68.24,18.01 0 bottom
U1  82.32,29.15 90 bottom
U$1  22.26,52.15 0 top
U$2  22.26,68.66 0 bottom
U$3  73.27,11.45 90 bottom
U$4  73.27,17.72 90 bottom
U$5  78.55,17.72 90 bottom
U$6  78.55,11.45 90 bottom
U$7  83.83,11.45 90 bottom
U$8  83.83,17.72 90 bottom
U$9  76.54,28.15 270 bottom
U$10  42.52,12.61 0 top
U$11  53.31,25.31 0 top
U$12  53.31,12.61 0 top
U$13  64.11,25.31 0 top
U$14  64.11,12.61 0 top
U$15  3.81,20.64 0 top
U$16  82.32,29.15 0 top
U$17  81.05,32.76 0 top
U$18  42.52,25.31 0 top
U$19  53.31,18.96 0 top
U$20  14.61,20.64 0 top
U$21  84.4,75.39 90 top
U$22  19.68,23.18 180 top
U$23  54.65,68.66 0 bottom
U$24  8.89,23.18 180 top
U$25  30.48,23.18 180 top
U$26  25.4,20.64 0 top
U$27  54.65,52.15 0 top
U$29  17.14,18.73 0 top
U$38  81.05,16.93 180 bottom

### Tracks (layer width: path | path; a pad name or v marks a point on that pad's centre or on a via)
+3V3  (via drill 0.2)  (1 unrouted)
  Top 0.152: C65.1 74.64,27.98 | 74.64,27.98 v73.84,27.18 | U$16.P$39 80.85,32.13 80.85,32.19 80.47,32.57 v80.47,32.6 | R5.2 77.54,27.77 77.54,27.67 77.44,27.57 76.61,27.57 76.43,27.75 74.87,27.75 74.64,27.98 | U$16.P$25 85.54,28.4 85.59,28.35 86.02,28.35 C50.1
  Route2 0.152: v80.47,32.6 80.32,32.45 80.32,32.43 79.97,32.09 v79.42,32.09 79.39,32.09 78.01,30.71 77.57,30.71 76.46,29.6 75.04,29.6 C65.1
  Route15 0.152: R3.1 88.05,31.32 R2.1 | R2.1 87.93,29.86 v87.93,29.68 87.93,28.89 C50.1 86.88,27.48 86.88,26.35 C57.1 | v80.47,32.6 80.62,32.45 80.62,32.43 81.2,31.85 84.75,31.85 85.59,31 86.79,31 R2.1
  Bottom 0.152: v80.47,32.6 80.32,32.45 U1.19 | U1.27 84.32,32.07 84.87,32.62 85.98,32.62 C27.1 C52.1 87.32,32.07 87.32,32.06 87.86,31.53 R3.1 | U1.1 84.56,26.45 84.81,26.7 85.33,26.7 86.07,25.96 C57.1 C53.1 | C56.1 v79.42,32.09 | R4.1 88.05,29.68 v87.93,29.68
  other vias: 74.64,29.2 86.7,27.66 88.05,31.53 87.26,30.53 86.49,25.96
A_P1  (via drill 0.55)
  Top 0.813: v76.25,16.19 77.53,14.92 PAD1.1 79.02,15.48 v79.02,16.19
  Route2 0.152: U$38.SHA 77.55,20.32 v77.66,20.21
  Bottom 0.152: U$3.S 75.77,17.8 U$4.D1
  Bottom 0.813: v76.25,16.19 v79.02,16.19
  other vias: 76.94,16.19 77.64,16.19 78.33,16.19 76.97,20.21 76.97,18.14 77.66,18.83 76.97,18.83 77.66,18.14 77.66,19.52 76.37,19.86 76.97,19.52 76.37,19.17
  pour Route2 (no thermals): 76,20.58 78.75,20.58 78.75,15.82 76.3,15.82 76.3,18.54 76,18.54
  pour Bottom (no thermals): 73.31,16.79 78.29,16.79 78.29,21.88 73.31,21.88
  pour Route2 (no thermals): 76,20.58 78.75,20.58 78.75,15.82 76.3,15.82 76.3,18.54 76,18.54
  pour Route15 (no thermals): 76,20.58 78.75,20.58 78.75,15.82 76.3,15.82 76.3,18.54 76,18.54
A_P2  (via drill 0.2, 1)  (1 unrouted)
  Route2 0.203: U$19.SHA 42.52,19.1 U$10.D
  Bottom 1.27: v46.97,24.36 v44.42,24.36 v44.42,21.82 v46.97,21.82 | v44.42,23.09 v46.97,23.09
  other vias: 42.52,21.11 45.69,21.82 45.69,23.09 45.69,24.36
  pour Top (isolate 0.305, no thermals): 47.51,27.56 37.52,27.56 37.52,17.68 47.51,17.68
A_P3
  Top 1.27: U$24.S U$15.D 6.35,19.37 6.99,18.73 10.48,18.73 11.75,20 PAD7.1
  Route2 0.203: U$29.SHA 6.35,18.87 U$15.D
ADC_VA_S
  Bottom 0.089: U1.7 81.57,26.2 81.57,26.1 81.65,26.02 81.99,26.02 82.07,26.1 82.07,26.81 81.75,27.13 80.18,27.13 79.91,27.4 79.08,27.4 78.34,28.15 U$9.1 | 76.33,28.36 U$9.1 | 76.22,28.15 U$9.1 | C62.1 76.74,29.2 0008.2 | 0007.1 C62.1 | U$9.1 76.37,28.15 | U$9.1 76.33,28.15 C62.1
ADC_VB_S  (via drill 0.2)  (1 unrouted)
  Route15 0.089: C63.1 74.64,31.28 74.28,30.92 74.28,28.03 76.07,26.23 v76.54,26.23
  Bottom 0.089: U$9.3 79.99,26.25 80.22,26.02 80.42,26.02 80.57,26.16 80.57,26.2 U1.8 | C63.1 0010.2 0009.1
  other vias: 74.64,31.56
ADC_VC_S  (via drill 0.2)  (1 unrouted)
  Top 0.089: C64.1 74.64,29.71 73.48,28.55 73.48,27.03 73.84,26.67 v73.84,26.23
  Bottom 0.089: 80.27,26.45 U1.9 77.32,26.45 77.1,26.67 75.96,26.67 75.54,26.25 U$9.4 | 0004.2 C64.1 0003.1
  other vias: 74.64,30.77
ADC_VM_S
  Bottom 0.089: U1.10 78.11,27.15 78.08,27.18 77.41,27.18 77.17,27.42 77.17,27.5 77.09,27.58 74.4,27.58 U$9.6 73.9,28.09 74.76,28.09 75.39,28.71 75.68,28.71 75.82,28.86 75.82,31.11 75.97,31.25 76.02,31.25 0011.1 76.63,31.25 76.68,31.25 | 76.68,31.25 | 76.68,31.25 C66.1 0012.2
B_P1  (via drill 0.55)
  Route2 0.152: U$38.SHB 82.26,22.88 82.26,19.02 v82.07,18.83
  Bottom 0.152: 80.35,19.12 U$6.S
  other vias: 79.99,18.83 80.68,18.83 81.38,18.83 79.3,18.83 79.99,18.14 80.68,18.14 81.38,18.14 79.3,18.14 82.07,18.14 82.76,18.14 82.76,18.83
  pour Top (no thermals): 78.96,11.49 78.96,19.2 83.15,19.2 83.15,11.49
  pour Bottom (no thermals): 78.8,16.79 78.8,21.88 83.57,21.88 83.57,16.79
B_P2  (via drill 0.2, 1)
  Top 0.203: v53.31,19.11 U$12.D
  Route2 0.203: U$19.SHB v53.31,19.11
  Bottom 1.27: PAD5.1 53.95,24.36 | 53.95,24.36 v54.59,24.36 v54.59,21.82 | PAD5.1 54.59,22.45 v54.59,21.82 | v54.59,21.82 v52.05,21.82 v52.05,24.36 53.95,24.36 | PAD5.1 53.95,23.72 v54.59,23.09
  other vias: 53.31,23.09 53.31,21.82 52.04,23.09 53.31,24.36
  pour Top (isolate 0.305, no thermals): 48.31,27.56 58.32,27.56 58.32,17.68 48.31,17.68
B_P3
  Top 1.27: U$22.S U$20.D 17.14,19.68 18.1,18.73 20.95,18.73 22.23,20 PAD8.1
  Route15 0.203: U$29.SHB U$20.D
C_P1  (via drill 0.55)
  Route2 0.152: U$38.SHC 83.14,23.74 83.34,23.54 83.34,22.66 84.48,21.52 84.48,20.26 v84.43,20.21
  Bottom 0.152: 86.18,19.82 U$8.D1 86.33,17.8 U$7.S
  other vias: 85.12,20.21 85.12,18.14 84.43,18.83 85.12,18.83 84.43,18.14 84.43,19.52 85.72,19.86 85.12,19.52 85.72,19.17
  pour Top (no thermals): 83.34,11.49 83.34,20.58 86.09,20.58 86.09,16.69 85.62,16.69 85.62,11.49
  pour Bottom (no thermals): 83.81,16.8 88.77,16.8 88.77,21.88 83.81,21.88
C_P2  (via drill 0.2, 1)
  Top 0.203: v64.11,17.84 U$14.D
  Route2 0.203: U$19.SHC 61.45,17.84 v64.11,17.84
  Bottom 1.27: v62.2,21.82 v62.2,24.36 v59.66,24.36 | v62.2,21.82 61.57,21.82 PAD6.1 v59.66,21.82 v62.2,21.82 | v60.94,24.36 v60.94,21.82
  other vias: 60.93,23.09 59.66,23.09 62.2,23.09
  pour Top (isolate 0.305, no thermals): 59.11,17.68 59.11,27.56 69.11,27.56 69.11,17.68
C_P3
  Top 1.27: PAD9.1 23.11,25.46 U$25.S U$26.D
  Route15 0.203: U$29.SHC 27.94,20.27 U$26.D
CAN_RX_S  (via drill 0.2)
  Route15 0.089: v82.09,32.6 82.13,32.6 82.67,32.06 84.84,32.06 85.37,31.52 85.74,31.52 86.64,32.41 87.53,32.41 v87.71,32.23
  Bottom 0.089: U1.23 82.32,32.37 v82.09,32.6 | v87.71,32.23 87.81,32.33 U$17.CAN_RX
CAN_TX_S  (via drill 0.2)
  Route15 0.089: v82.64,32.6 82.67,32.6 83.03,32.23 84.67,32.23 85.03,32.59 87.86,32.59 U$17.CAN_TX
  Bottom 0.089: U1.24 82.82,32.41 v82.64,32.6
CPH_S
  Top 0.152: U$16.P$3 79.35,30.9 79.17,30.73 78.32,30.73 C25.1
CPL_S
  Top 0.152: C25.2 78.96,31.4 U$16.P$2
ENABLE_S  (via drill 0.2)
  Top 0.089: U$16.P$32 84.57,26.9 v85.17,26.31
  Bottom 0.089: U1.2 84.07,26.2 84.07,26.16 84.22,26.02 84.42,26.02 84.71,26.31 v85.17,26.31
GHA_P1
  Bottom 0.152: U$38.GHA 77.16,23.79 77.16,22.95 77.25,22.86 77.69,22.86 78.41,22.14 78.41,17.84 U$3.G
GHA_P2
  Top 0.203: 47.71,13.21 47.8,13.12 | 47.8,13.12 U$19.GHA | 47.8,13.12 47.8,21.32 47.91,21.43 47.91,25.33 U$18.G
GHA_P3
  Route15 0.203: U$24.G 8.89,21.97 7.95,21.03 7.95,16.57 U$29.GHA
GHA_S
  Top 0.203: U$17.GHA 76.89,25.6 77.6,26.31 78.21,26.31 78.36,26.46 78.36,27.63 79.13,28.4 79.13,28.56 79.47,28.9 U$16.P$7
GHB_P1
  Bottom 0.152: U$6.G 82.95,17.14 83.53,17.72 83.53,22.32 83.26,22.6 82.45,22.6 82.19,22.85 82.19,23.66 81.97,23.89 81.95,23.89 U$38.GHB
GHB_P2  (via drill 0.2)
  Route2 0.203: U$19.GHB 54.01,19.2 57.52,22.7 U$11.G
  other vias: 57.51,26.51
GHB_P3
  Route15 0.203: U$29.GHB 17.84,16.42 18.09,16.66 18.09,21.58 U$22.G
GHB_S
  Top 0.203: U$17.GHB 82.07,25.93 U$16.P$16
GHC_P1
  Bottom 0.152: U$7.G 87.76,17.1 87.25,16.58 84.01,16.58 83.84,16.75 83.84,22.36 83.34,22.86 82.53,22.86 82.43,22.95 82.43,23.79 82.44,23.8 U$38.GHC
GHC_P2  (via drill 0.2)
  Route2 0.203: U$19.GHC 55.19,12.28 55.35,12.28 65.22,22.15 65.77,22.15 68.31,24.69 U$13.G
  other vias: 68.31,26.51
GHC_P3
  Route15 0.203: U$25.G 30.15,23.18 28.55,21.58 27.55,21.58 27,21.03 27,20.03 U$29.GHC
GHC_S
  Top 0.203: U$17.GHC 82.57,25.73 U$16.P$17
GLA_P1
  Bottom 0.152: U$4.G 78.25,23.95 U$38.GLA
GLA_P2  (via drill 0.2)  (1 unrouted)
  Route15 0.203: U$19.GLA 50.48,11.8 50.02,12.27 48.43,12.27 v46.73,13.96
GLA_P3
  Route2 0.203: U$15.G 5.02,20.64 5.96,21.58 6.74,21.58 7.29,21.03 7.29,18.63 U$29.GLA
GLA_S
  Top 0.203: U$17.GLA 78.89,26.23 78.89,27.32 79.47,27.9 U$16.P$9
GLB_P1  (via drill 0.2)
  Top 0.152: U$38.GLB 80.79,23.65 82.67,23.65 U$5.G
  other vias: 82.95,23.37
GLB_P2
  Top 0.203: U$19.GLB 53.14,12.32 56.83,12.32 57.51,13 U$12.G
GLB_P3
  Route15 0.203: U$29.GLB 16.45,18.8 U$20.G
GLB_S
  Top 0.203: U$17.GLB 80.71,25.96 80.73,25.96 81.07,26.31 U$16.P$14
GLC_P1
  Bottom 0.152: U$8.G 88.23,22.65 87.67,22.09 84.45,22.09 83.84,22.7 U$38.GLC
GLC_P2  (via drill 0.2)
  Route2 0.203: U$19.GLC 56.85,12.54 67.04,12.54 U$14.G
  other vias: 68.31,13.81
GLC_P3
  Route2 0.203: U$29.GLC 19.94,15.18 U$26.G
GLC_S
  Top 0.203: U$17.GLC 83.57,25.86 U$16.P$19
GND  (via drill 1)
  other vias: 69.57,62.31 69.57,63.58 69.57,64.85 69.57,66.12 69.57,67.39 69.57,68.66 7.34,62.31 7.34,63.58 7.34,64.85 7.34,66.12 7.34,67.39 7.34,68.66 37.19,62.31 37.19,63.58 37.19,64.85 37.19,66.12 37.19,67.39 37.19,68.66 39.73,62.31 39.73,63.58 39.73,64.85 39.73,66.12 39.73,67.39 39.73,68.66
  pour Top (isolate 0.305, rank 6, no thermals): 0,99.69 99.69,99.69 99.69,0 0,0
  pour Route2 (isolate 0.305, rank 6, no thermals): 0,0 0,99.69 99.69,99.69 99.69,0
GND_P1  (via drill 0.2, 0.55)
  Top 0.152: TP3.TP 74.87,16.13 0005.1 | TP4.TP 87.22,16.14 0006.1 87.22,17.29 v88.33,16.18
  Route2 0.152: U$38.SNC 85.39,23.94 87.71,23.94 88.67,22.99 88.67,16.52 v88.33,16.18
  Bottom 0.152: U$38.SNA 79.65,24.07 U$5.S
  other vias: 79.59,23.29 80.28,23.29 81.67,22.6 78.9,23.29 79.59,22.6 80.28,22.6 80.98,22.6 78.9,22.6
  pour Bottom (no thermals): 78.53,22.05 83.57,22.05 83.57,23.74 78.53,23.74
  pour Top (rank 2, no thermals): 73.32,11.49 88.78,11.49 88.78,24.05 73.32,24.05
  pour Route2 (rank 2, no thermals): 73.32,11.49 88.78,11.49 88.78,24.05 73.32,24.05
  pour Route15 (rank 2, no thermals): 73.32,11.49 88.78,11.49 88.78,24.05 73.32,24.05
GND_P2  (via drill 1)
  Top 0.203: U$19.SNA 51.92,13.01 U$12.S
  Bottom 0.203: U$19.SNC 57.51,16.3 0002.1
  other vias: 56.49,16.43 49.5,15.15 50.77,15.15 52.04,15.15 50.77,13.88 52.04,13.88 55.22,15.15 55.22,13.88 49.5,16.42 50.77,16.42 52.04,16.42 55.22,16.42
  pour Bottom (isolate 0.305, rank 2, no thermals): 37.44,11.98 69.19,11.98 69.19,27.85 37.44,27.85
  pour Route15 (isolate 0.305, rank 2, no thermals): 37.44,11.98 69.19,11.98 69.19,27.85 37.44,27.85
  pour Route2 (isolate 0.305, rank 2, no thermals): 37.44,11.98 69.19,11.98 69.19,27.85 37.44,27.85
  pour Top (isolate 0.305, no thermals): 37.52,11.67 69.11,11.67 69.11,17.5 37.52,17.5
GND_P3  (via drill 0.35, 1)
  Route2 0.203: U$29.SNA 15.75,11.87 v13.34,14.29
  Route15 0.203: U$29.SNC 21.72,11.96 v23.65,11.96
  Bottom 0.203: U$29.VSS_2 U$29.VSS_1 13.34,18.7
  other vias: 32.07,13.97 32.07,12.7 2.22,13.97 2.22,12.7 32.07,15.24 32.07,16.51 32.07,17.78 32.07,19.05 2.22,15.24 2.22,16.51 2.22,17.78 2.22,19.05 9.58,12.31 10.83,12.32 24.27,12.48 22.99,12.42
  pour Bottom (isolate 0.305, no thermals): 1.27,21.91 33.02,21.91 33.02,11.75 1.27,11.75
  pour Top (isolate 0.305, no thermals): 1.27,11.75 1.27,21.59 33.02,21.59 33.02,11.75
  pour Route15 (isolate 0.305, no thermals): 1.27,21.91 33.02,21.91 33.02,11.75 1.27,11.75
  pour Route2 (isolate 0.305, no thermals): 1.27,21.91 33.02,21.91 33.02,11.75 1.27,11.75
GND_S  (via drill 0.2)
  Top 0.152: U$16.P$40 80.35,32.13 80.35,32.16 79.92,32.58 v79.92,32.6 | U$17.VSS_1 U$17.VSS_2 77.8,32.66 C70.2 77.63,32.21 C28.2 77.2,32.34 U$17.VSS_1 | C51.2 76.95,28.11 C59.2 75.81,28.78 v75.39,29.2 | U$16.P$26 85.38,28.9 85.69,28.59 86.67,28.59 v86.7,28.62 | U$17.GND 87.92,31.13 87.89,31.13 87.62,31.4 C52.2 | U$17.VSS_1 76.72,32.27 76.72,32.18 75.7,31.17 74.47,31.17 74.08,31.56 C63.2 | v80.47,31 U$16.P$1 82.43,29.05 v84.17,29.05
  Route2 0.152: C27.2 85.45,31.4 84.78,32.06 84.78,32.08 v84.27,32.59 84.17,32.5 v84.17,30.88 | v76.26,27.18 75.78,27.66 75.36,27.66 73.82,29.21 v73.63,29.21
  Route15 0.152: C57.2 86.49,27.32 86.31,27.5 86.31,28.23 v86.7,28.62 86.05,28.62 86.02,28.59 84.62,28.59 v84.17,29.05 | C53.2 88.38,28.06 88.38,29.72 88.82,30.16 U$17.GND | C27.2 86.2,31.31 | 79.92,32.59 v79.92,32.6 79.92,31.55 v80.47,31
  Bottom 0.089: 83.82,27.65 U$16.P$1
  Bottom 0.152: U$9.2 76.28,27.2 v76.26,27.18 | 83.82,31.77 U1.26 83.82,32.14 84.12,32.43 84.12,32.44 v84.27,32.59 | 0012.1 C66.2 78.01,31.24 | v79.92,32.6 80.04,32.48 80.04,31.57 U1.18 79.56,31.09 C56.2 78.16,31.09 78.01,31.24 | 78.01,32.3 0012.1 | C27.2 C52.2 | U1.35 U1.36 85.56,27.15 85.7,27.02 86.43,27.02 C57.2 C53.2 | v86.7,28.62 C50.2 | 0012.1 77.9,32.16 U$17.VSS_2 | 0008.1 77.29,30.74 77.38,30.74 77.88,31.24 78.01,31.24 | C65.2 v73.63,29.21 | v75.39,29.2 75.32,29.13 75.32,28.98 75.03,28.68 74.15,28.68 C65.2 | C65.2 0004.1 C64.2 C63.2 0010.1 | v84.17,30.88 82.44,29.15 U$16.P$1 U1.5
  other vias: 86.49,26.96 87.27,26.96 86.2,31.4 86.99,31.4 73.64,31.56 82.32,29.15 80.47,28.41 75.2,25.89 77.84,31.92 82.4,26.96
  pour Top (no thermals): 73.34,32.7 88.76,32.7 88.76,25.67 73.34,25.67
  pour Route2 (no thermals): 73.34,32.7 88.76,32.7 88.76,25.67 73.34,25.67
  pour Route15 (no thermals): 73.34,32.7 73.34,25.67 88.76,25.67 88.76,32.7
  pour Bottom (no thermals): 73.34,32.7 73.34,25.67 88.76,25.67 88.76,32.7
IN_ADC_PWM  (via drill 0.2)
  Route2 0.089: U$17.IN 88.35,26.74 88.15,26.54 86.22,26.54 85.44,27.32 79.17,27.32 78.25,28.23 v75.72,28.23
  Bottom 0.089: R6.1 77.77,27.61 77.62,27.77 75.96,27.77 75.9,27.82 75.9,28.05 v75.72,28.23
INHA_S  (via drill 0.2)
  Top 0.089: U$16.P$33 84.4,32.23 84.42,32.23 84.47,32.29 84.67,32.29 84.81,32.14 84.81,32.08 85.03,31.87 85.32,31.87 85.34,31.88 v85.59,31.88
  Bottom 0.089: U1.20 80.82,31.75 81.33,31.24 84.5,31.24 84.66,31.41 84.9,31.41 85.37,31.88 v85.59,31.88
INHB_S  (via drill 0.2)
  Top 0.089: U$16.P$35 83.07,32.3 83.18,32.41 v83.18,32.6
  Bottom 0.089: v83.18,32.6 83.18,32.41 83.07,32.29 83.07,31.5 82.99,31.42 81.65,31.42 81.32,31.75 U1.21
INHC_S  (via drill 0.2)
  Top 0.089: U$16.P$37 81.81,32.16 81.81,32.18 81.55,32.44 v81.55,32.6
  Bottom 0.089: v81.55,32.6 81.82,32.33 U1.22
INLA_S  (via drill 0.2)
  Top 0.089: U$16.P$34 83.57,32.32 83.72,32.47 v83.72,32.6
  Route2 0.089: v83.72,32.6 83.72,32.47 80.92,29.66 78.07,29.66 77.99,29.75 v77.73,29.75
  Bottom 0.089: U1.14 79.52,29.15 79.2,29.48 78,29.48 v77.73,29.75
INLB_S  (via drill 0.2)
  Top 0.089: U$16.P$36 82.57,31.55 82.38,31.36 80.25,31.36 80.08,31.18 80.08,29.85 79.88,29.65 78.59,29.65 v78.21,30.03
  Bottom 0.089: U1.15 78.59,29.65 v78.21,30.03
INLC_S  (via drill 0.2)
  Top 0.089: U$16.P$38 81.31,32.16 81.31,32.18 81.01,32.48 v81.01,32.59
  Route2 0.089: v78.75,30.02 78.75,30.35 81,32.59 v81.01,32.59
  Bottom 0.089: U1.16 78.83,30.15 78.75,30.08 v78.75,30.02
LED_S
  Bottom 0.089: R7.1 88.14,26.04 U$17.LED
N$1
  Top 0.152: U$21.SNC 91.83,79.84 91.83,82.76 93.8,84.73 93.8,84.78 JP4.3
N$2
  Top 0.152: U$21.SPC 92.11,79.43 92.11,81.97 94.15,84.01 95.57,84.01 JP4.4
N$3
  Top 0.152: U$21.GLC 92.39,79.01 92.39,80.83 JP4.5
N$4
  Top 0.152: U$21.SHC 92.69,78.6 92.69,80.01 94.15,81.47 94.67,81.47 96.2,83.01 JP4.6
N$5
  Top 0.152: U$21.GHC 93,78.22 93,78.98 94.49,80.47 JP4.7
N$6
  Top 0.152: U$21.GHB 93.29,77.81 93.29,78.44 94.32,79.46 94.98,79.46 95.98,80.47 JP4.8
N$7
  Top 0.152: U$21.SHB 94.11,77.93 JP5.1
N$8
  Top 0.152: U$21.GLB 93.53,76.66 95.83,76.66 JP5.2
N$9
  Top 0.152: U$21.SNA 92.96,75.39 JP5.3
N$10
  Top 0.152: U$21.SPA 92.38,74.11 95.82,74.11 JP5.4
N$11
  Top 0.152: U$21.GLA 91.82,72.85 JP5.5
N$12
  Top 0.152: U$21.SHA 93.6,71.89 93.92,71.58 95.83,71.58 JP5.6
N$13
  Top 0.152: U$21.GHA 93.67,71.2 JP5.7
N$14
  Top 0.152: U$21.CAN_RX 84.4,83.59 JP3.1
N$15  (via drill 0.2)
  Top 0.152: C51.1 R5.1 77.93,26.92 v77.93,26.82
  Bottom 0.089: 81.82,26.35 U1.6
  Bottom 0.152: U1.6 81.82,26.61 81.5,26.92 80.2,26.92 80.02,26.73 78.02,26.73 v77.93,26.82
N$16
  Top 0.152: U$21.CAN_TX 85.53,84.81 85.65,84.92 85.65,86.84 JP3.2
N$17  (via drill 0.2)
  Bottom 0.089: U1.13 79.37,28.9 79.27,28.9 79.19,28.98 79.19,29.11 79.01,29.3 78.5,29.3 R6.2 77.95,28.75 C59.1
  other vias: 77.95,28.78
N$18
  Route2 0.203: U$1.1 11.38,52.69 11.38,65.11 U$2.CAN_RX
N$19  (via drill 0.2)
  Route2 0.089: v77.73,30.32 77.73,30.26 77.37,29.9 77.37,29.6 77.67,29.3 78.98,29.3 79.19,29.09 79.19,28.83 80.16,27.86 85.25,27.86 85.71,28.31 86.01,28.31 86.3,28.02 86.85,28.02 87.91,26.96 R7.2
  Bottom 0.089: 79.42,30.65 U1.17 78.07,30.66 v77.73,30.32
  other vias: 88.06,26.96
N$20
  Top 0.152: U$21.SWCLK 86.23,84.84 JP3.3
N$21
  Top 0.152: U$21.GND 86.93,83.77 88.15,84.99 88.15,86.88 JP3.4
N$22
  Top 0.152: U$21.SWDIO 87.63,83.69 JP3.5
N$23
  Top 0.152: U$21.NRST 89.46,84.29 89.9,84.29 90.68,85.06 90.68,86.89 JP3.6
N$24
  Route2 0.203: U$1.2 11.67,53.85 11.67,64.71 U$2.CAN_TX
N$25
  Top 0.152: U$21.UART_RX 89.85,83.98 90.46,83.98 JP3.7
N$26
  Top 0.152: U$21.UART_TX 90.28,83.72 90.58,83.72 91.4,84.54 92.44,84.54 93.03,85.13 93.03,85.96 92.02,86.97 JP3.8
N$27
  Top 0.152: U$21.IN 91.45,84.19 92.42,84.19 93.32,85.08 93.32,86.06 94.56,87.31 JP4.1
N$28
  Top 0.152: U$21.LED 91.12,83.38 91.69,83.95 92.68,83.95 93.56,84.83 93.56,85.96 94.68,87.08 94.98,87.08 95.98,88.09 JP4.2
N$29
  Route2 0.203: U$1.3 11.96,56.1 11.96,64.3 U$2.SWCLK
N$30
  Route2 0.203: U$1.4 12.26,58.34 12.26,63.89 U$2.GND
N$31
  Route2 0.203: U$1.5 20.83,52.15 12.55,60.43 12.55,63.49 U$2.SWDIO
N$32
  Route2 0.203: U$1.6 16.5,59.18 14.21,59.18 12.84,60.55 12.84,63.08 U$2.NRST
N$33
  Route2 0.203: U$1.7 18.75,59.47 14.33,59.47 13.13,60.67 13.13,62.67 U$2.UART_RX
N$34
  Route2 0.203: U$1.8 20.99,59.77 14.45,59.77 13.42,60.79 13.42,62.27 U$2.UART_TX
N$35
  Route2 0.203: U$1.9 23.19,60.11 14.52,60.11 13.72,60.91 13.72,61.86 U$2.IN
N$36
  Route2 0.203: U$1.10 25.44,60.4 14.64,60.4 14.01,61.04 14.01,61.67 14.28,61.94 U$2.LED
N$37
  Route2 0.203: U$27.1 43.76,52.69 43.76,65.11 U$23.CAN_RX
N$38
  Route2 0.203: U$27.2 44.06,53.85 44.06,64.71 U$23.CAN_TX
N$39
  Route2 0.203: U$27.3 44.35,56.1 44.35,64.3 U$23.SWCLK
N$40
  Route2 0.203: U$27.4 44.64,58.34 44.64,63.89 U$23.GND
N$41
  Route2 0.203: U$27.5 53.22,52.15 44.93,60.43 44.93,63.49 U$23.SWDIO
N$42
  Route2 0.203: U$27.6 48.88,59.18 46.59,59.18 45.23,60.55 45.23,63.08 U$23.NRST
N$43
  Route2 0.203: U$27.7 51.13,59.47 46.72,59.47 45.52,60.67 45.52,62.67 U$23.UART_RX
N$44
  Route2 0.203: U$27.8 53.38,59.77 46.84,59.77 45.81,60.79 45.81,62.27 U$23.UART_TX
N$45
  Route2 0.203: U$27.9 55.58,60.11 46.91,60.11 46.1,60.91 46.1,61.86 U$23.IN
N$46
  Route2 0.203: U$27.10 57.82,60.4 47.03,60.4 46.39,61.04 46.39,61.67 46.66,61.94 U$23.LED
NFAULT_S  (via drill 0.2)
  Top 0.089: U$16.P$27 85.65,29.4 85.71,29.34 86.01,29.34 86.24,29.57 87.22,29.57 R2.2
  Bottom 0.089: 83.32,26.56 U1.3 83.32,26.88 83.61,27.17 84.17,27.17 84.31,27.3 84.31,28.54 84.67,28.9 85.38,28.9 85.45,28.98 85.45,29.18 85.61,29.34 86.01,29.34 86.06,29.39 86.62,29.39 86.76,29.53 R2.2
  other vias: 87.26,29.53
NRST_S
  Bottom 0.089: 82.82,26.35 U1.4 83.07,26.2 83.07,26.1 83.15,26.02 83.49,26.02 83.57,26.1 83.57,26.8 83.76,26.99 84.25,26.99 84.59,27.33 84.59,28.32 84.67,28.4 85,28.4 | 85,28.4 | 85,28.4 85.38,28.4 85.6,28.62 86.01,28.62 86.22,28.83 86.22,29.02 86.29,29.1 87.61,29.1 R4.2 88.22,28.84 U$17.NRST
NSCS_S  (via drill 0.2)
  Top 0.089: U$16.P$31 85.33,31.15 85.34,31.15 85.89,30.6 v86.05,30.6
  Bottom 0.089: v86.05,30.6 86,30.65 U1.29
SCLK_S  (via drill 0.2)
  Top 0.089: U$16.P$30 85.24,30.9 85.9,30.24 86.2,30.24 86.56,30.6 v86.59,30.6
  Bottom 0.089: v86.59,30.6 86.56,30.6 86.2,30.24 85.11,30.24 U1.30
SDI_S  (via drill 0.2)
  Top 0.089: U$16.P$29 85.49,30.4 85.83,30.06 86.27,30.06 v86.4,29.93
  Bottom 0.089: v86.4,29.93 86.14,29.93 86.01,30.06 85.71,30.06 85.55,29.9 84.67,29.9 84.59,29.82 84.59,29.48 84.67,29.4 84.77,29.4 U1.32
SDO_S  (via drill 0.2)
  Top 0.089: U$16.P$28 85.66,29.9 v85.86,29.7
  Bottom 0.089: U1.31 85.07,29.7 v85.86,29.7 86.12,29.7 86.25,29.57 86.55,29.57 86.78,29.8 86.78,29.88 86.99,30.1 87.67,30.1 87.75,30.17 87.75,30.22 R3.2
SHA_S  (via drill 0.2)  (1 unrouted)
  Top 0.152: U$17.SHA 77.62,25.6 78.07,26.04 78.32,26.04 78.62,26.35 78.62,27.52 79.51,28.4 U$16.P$8
  Top 0.203: 77.59,25.6 U$17.SHA
  Route15 0.089: 77.59,25.6 76.9,26.3 76.9,26.38 76.46,26.82 76.11,26.82 75.9,27.03 75.9,27.33 76.08,27.51 76.08,30.51 75.97,30.62 75.97,31.99 0009.2
  other vias: 76.33,32.35
SHB_S  (via drill 0.2)  (1 unrouted)
  Top 0.203: U$17.SHB 81.57,26.12 U$16.P$15
  Route15 0.089: U$17.SHB 80.94,25.6 80.53,26.01 78.02,26.01 76.33,27.71 0003.2
  other vias: 76.33,30.77
SHC_S  (via drill 0.2)  (1 unrouted)
  Top 0.203: U$17.SHC 83.07,25.67 U$16.P$18
  Route2 0.089: 83.13,25.6 81.68,27.05 79.18,27.05 78.36,27.87 75.45,27.87 74.28,29.05 74.28,29.35 75.03,30.1 75.03,31.26 0011.2
  other vias: 75.33,31.56
SNB_S
  Top 0.203: 80.07,26.02 U$17.SNA 79.65,26.83 U$16.P$11 | 80.07,26.02 U$16.P$12 | U$16.P$12 U$16.P$13 80.45,26.4 80.27,26.22 | 80.07,26.02 80.27,26.22 | U$16.P$12 80.25,26.22 80.27,26.22
SNC_S
  Top 0.203: U$17.SNC 84.57,26.26 U$16.P$21
SOA_S  (via drill 0.2)
  Top 0.089: U$16.P$24 85.81,27.9 v85.86,27.95
  Route2 0.089: v85.86,27.95 85.59,27.68 80.09,27.68 v78.83,28.94
  Bottom 0.089: 79.51,28.15 U1.12 79.52,28.15 79.19,28.48 79.19,28.53 | 79.19,28.53 79.19,28.58 | 79.19,28.53 78.83,28.89 v78.83,28.94
SOC_S  (via drill 0.2)
  Top 0.089: U$16.P$22 85.33,27.16 85.34,27.16 85.59,27.41 v85.86,27.41
  Route2 0.089: v78.57,28.43 79.5,27.5 85.77,27.5 v85.86,27.41
  Bottom 0.089: U1.11 79.52,27.65 78.74,28.43 v78.57,28.43
SPA_P1  (via drill 0.55)  (1 unrouted)
  Top 0.152: U$38.SPA 78.88,24.09 78.44,23.65 75.32,23.65 0005.2
  Bottom 0.152: U$4.S 74.52,23.37 v74.52,22.99
  other vias: 74.52,23.69 75.21,23.69 75.9,23.69 73.83,23.69 75.21,22.99 75.9,22.99 73.83,22.99
  pour Bottom (no thermals): 73.32,24.05 73.32,22.05 78.29,22.05 78.29,24.05
SPA_P2  (via drill 1)  (1 unrouted)
  Bottom 0.203: U$19.SPA 51.19,11.8 50.72,12.27 47.61,12.27 0001.2
  other vias: 38.71,13.88 39.98,13.88 41.25,13.88 42.52,13.88 43.79,13.88 45.06,13.88 45.06,15.15 43.79,15.15 42.52,15.15 41.25,15.15 39.98,15.15 38.71,15.15
  pour Bottom (isolate 0.305, no thermals): 37.44,16.42 48.87,16.42 48.87,11.98 37.44,11.98
SPA_P3
  Route2 0.203: U$29.SPA 8.89,17.73 U$15.S
  Bottom 1.27: U$15.S 10.96,18.57 0013.2
SPA_S
  Top 0.152: U$17.SPA 79.16,25.8 79.16,27.02 79.54,27.4 U$16.P$10
SPC_P1  (via drill 0.55)  (1 unrouted)
  Top 0.813: v86.92,22.67 v84.84,22.67 84.84,23.29
  Bottom 0.152: U$38.SPC 85.26,23.37 U$8.S
  other vias: 85.53,23.36 86.23,23.36 86.92,23.36 84.84,23.36 85.53,22.67 86.23,22.67
  pour Bottom (no thermals): 88.8,23.74 83.81,23.74 83.81,22.05 88.8,22.05
SPC_P2  (via drill 1)  (1 unrouted)
  Top 0.203: U$19.SPC 57.43,12.42 58.04,12.42 59.43,13.81 U$14.S
  other vias: 60.3,13.88 60.3,15.15 61.57,15.15 62.84,15.15 64.11,15.15 65.38,15.15 66.65,15.15 66.65,13.88 65.38,13.88 64.11,13.88 62.84,13.88 61.57,13.88
  pour Bottom (isolate 0.305, no thermals): 69.19,16.42 57.76,16.42 57.76,11.98 69.19,11.98
SPC_P3
  Route15 0.203: U$29.SPC 29.7,20.64 U$26.S
  Bottom 1.27: U$26.S 27.91,18.07 0014.2
SPC_S
  Top 0.203: U$17.SPC 84.07,26.06 U$16.P$20
SWCLK_S
  Bottom 0.089: U1.28 85.61,31.15 85.8,30.96 88.79,30.96 U$17.SWCLK
SWDIO_S  (via drill 0.2)
  Route2 0.089: v85.17,32.23 85.43,32.23 85.45,32.24 86.11,32.24 86.63,31.72 86.63,31.25 86.84,31.04 87.32,31.04 U$17.SWDIO
  Bottom 0.089: U1.25 83.32,31.75 83.65,31.42 84.42,31.42 85.17,32.17 v85.17,32.23
USART_RX_S
  Bottom 0.089: U1.34 85.09,28.22 85.45,28.22 85.67,28.45 86.08,28.45 86.3,28.23 88.72,28.23 U$17.UART_RX
USART_TX_S  (via drill 0.2)
  Top 0.089: v85.86,28.98 87.27,28.98 U$17.UART_TX
  Bottom 0.089: U1.33 85.38,28.65 85.71,28.98 v85.86,28.98
VCP_S
  Top 0.152: C26.2 77.22,29.36 77.89,29.36 77.94,29.4 U$16.P$6
VGLS_S
  Top 0.152: C70.1 79.07,31.76 79.19,31.76 79.25,31.7 79.87,31.7 U$16.P$41
VM  (via drill 0.2, 1)  (1 unrouted)
  Top 0.152: U$16.P$5 U$16.P$4 79.33,30.4 79.24,30.49 78.22,30.49 77.99,30.71 77.26,30.71 C26.1 | U$17.VCC_1 U$17.VCC_2 | C28.1 C26.1 | C26.1 76.62,30.52 76.49,30.38 75.78,30.38 v75.39,29.99
  Route2 0.152: v75.39,29.99 75.93,30.53 75.93,30.93 77.32,32.32 78.08,32.32 78.53,32.76 U$17.VCC_1
  Bottom 0.152: 0007.2 v75.39,29.99
  other vias: 37.19,86.12 37.19,84.85 37.19,83.58 37.19,82.31 37.19,81.04 37.19,79.77 39.73,79.77 39.73,81.04 39.73,82.31 39.73,83.58 39.73,84.85 39.73,86.12 69.57,86.12 69.57,84.85 69.57,83.58 69.57,82.31 69.57,81.04 69.57,79.77 7.34,86.12 7.34,84.85 7.34,83.58 7.34,82.31 7.34,81.04 7.34,79.77
  pour Bottom (isolate 0.305, rank 6, no thermals): 0,0 0,99.69 99.69,99.69 99.69,0
  pour Route15 (isolate 0.305, rank 6, no thermals): 0,0 0,99.69 99.69,99.69 99.69,0
VM_P1  (via drill 0.2, 0.55)  (2 unrouted)
  Top 0.152: U$38.VCC_1 U$38.VCC_2 78.96,17.27 v78.4,17.27
  Route2 0.152: v78.4,17.27 78.96,17.27 79.6,16.63 79.6,15.95 76.89,13.25 v75.07,13.25
  Bottom 0.152: U$3.D1 U$6.D1 U$7.D1
  other vias: 73.69,12.55 74.38,13.25 73.69,11.86 73.69,13.25 74.38,11.86 74.38,12.55 75.07,11.86 75.07,12.55 88.41,13.25 87.03,12.55 87.72,13.25 87.03,11.86 87.03,13.25 87.72,11.86 87.72,12.55 88.41,11.86 88.41,12.55
  pour Bottom (no thermals): 73.32,11.49 88.79,11.49 88.79,16.61 73.32,16.61
VM_P2  (via drill 0.2, 1)
  Top 0.203: v53.31,33.57 U$11.D
  Bottom 0.203: U$19.VCC_1 U$19.VCC_2 51.1,19.43 51.1,31.36 v53.31,33.57
  other vias: 68.24,28.8 68.24,30.07 68.24,31.34 68.24,32.61 68.24,33.88 68.24,35.15 68.24,36.42 38.39,36.42 38.39,35.15 38.39,33.88 38.39,32.61 38.39,31.34 38.39,30.07 38.39,28.8
  pour Top (isolate 0.305, no thermals): 37.52,37.31 69.11,37.31 69.11,27.77 37.52,27.77
  pour Bottom (isolate 0.305, no thermals): 37.44,37.38 69.19,37.38 69.19,28.17 37.44,28.17
  pour Route15 (isolate 0.305, no thermals): 37.44,37.38 69.19,37.38 69.19,28.17 37.44,28.17
  pour Route2 (isolate 0.305, no thermals): 37.44,37.38 69.19,37.38 69.19,28.17 37.44,28.17
VM_P3  (via drill 1)
  Top 1.27: U$24.D 6.35,25.72 17.14,25.72 | 17.14,25.72 17.14,29.53 27.94,29.53 U$25.D | 17.14,25.72 U$22.D
  Bottom 0.203: U$29.VCC_1 U$29.VCC_2 16.2,19.54 16.2,21.03 17.14,21.97 U$22.D
  other vias: 32.07,34.92 32.07,36.2 2.22,36.2 2.22,34.92 32.07,33.66 32.07,32.38 32.07,31.11 32.07,29.84 32.07,28.57 2.22,33.66 2.22,32.38 2.22,31.11 2.22,29.84 2.22,28.57
  pour Top (isolate 0.305, no thermals): 1.27,37.15 33.02,37.15 33.02,21.91 1.27,21.91
  pour Bottom (isolate 0.305, no thermals): 1.27,22.23 1.27,37.15 33.02,37.15 33.02,22.23
  pour Route15 (isolate 0.305, no thermals): 1.27,22.23 1.27,37.15 33.02,37.15 33.02,22.23
  pour Route2 (isolate 0.305, no thermals): 1.27,22.23 1.27,37.15 33.02,37.15 33.02,22.23